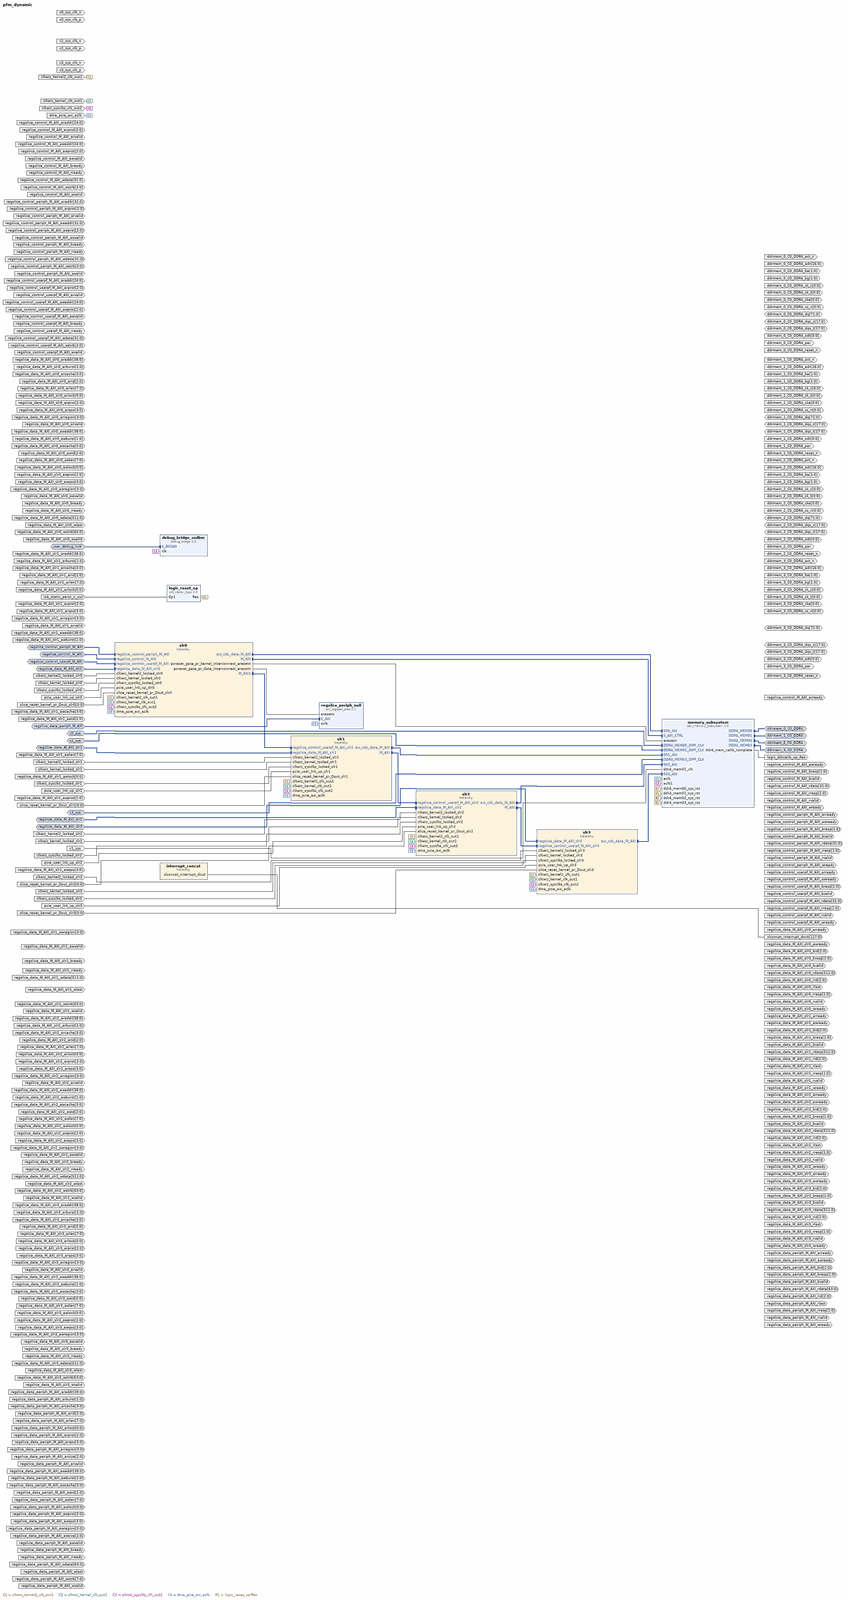
[diagram p0: block diagram of the top level, whole]
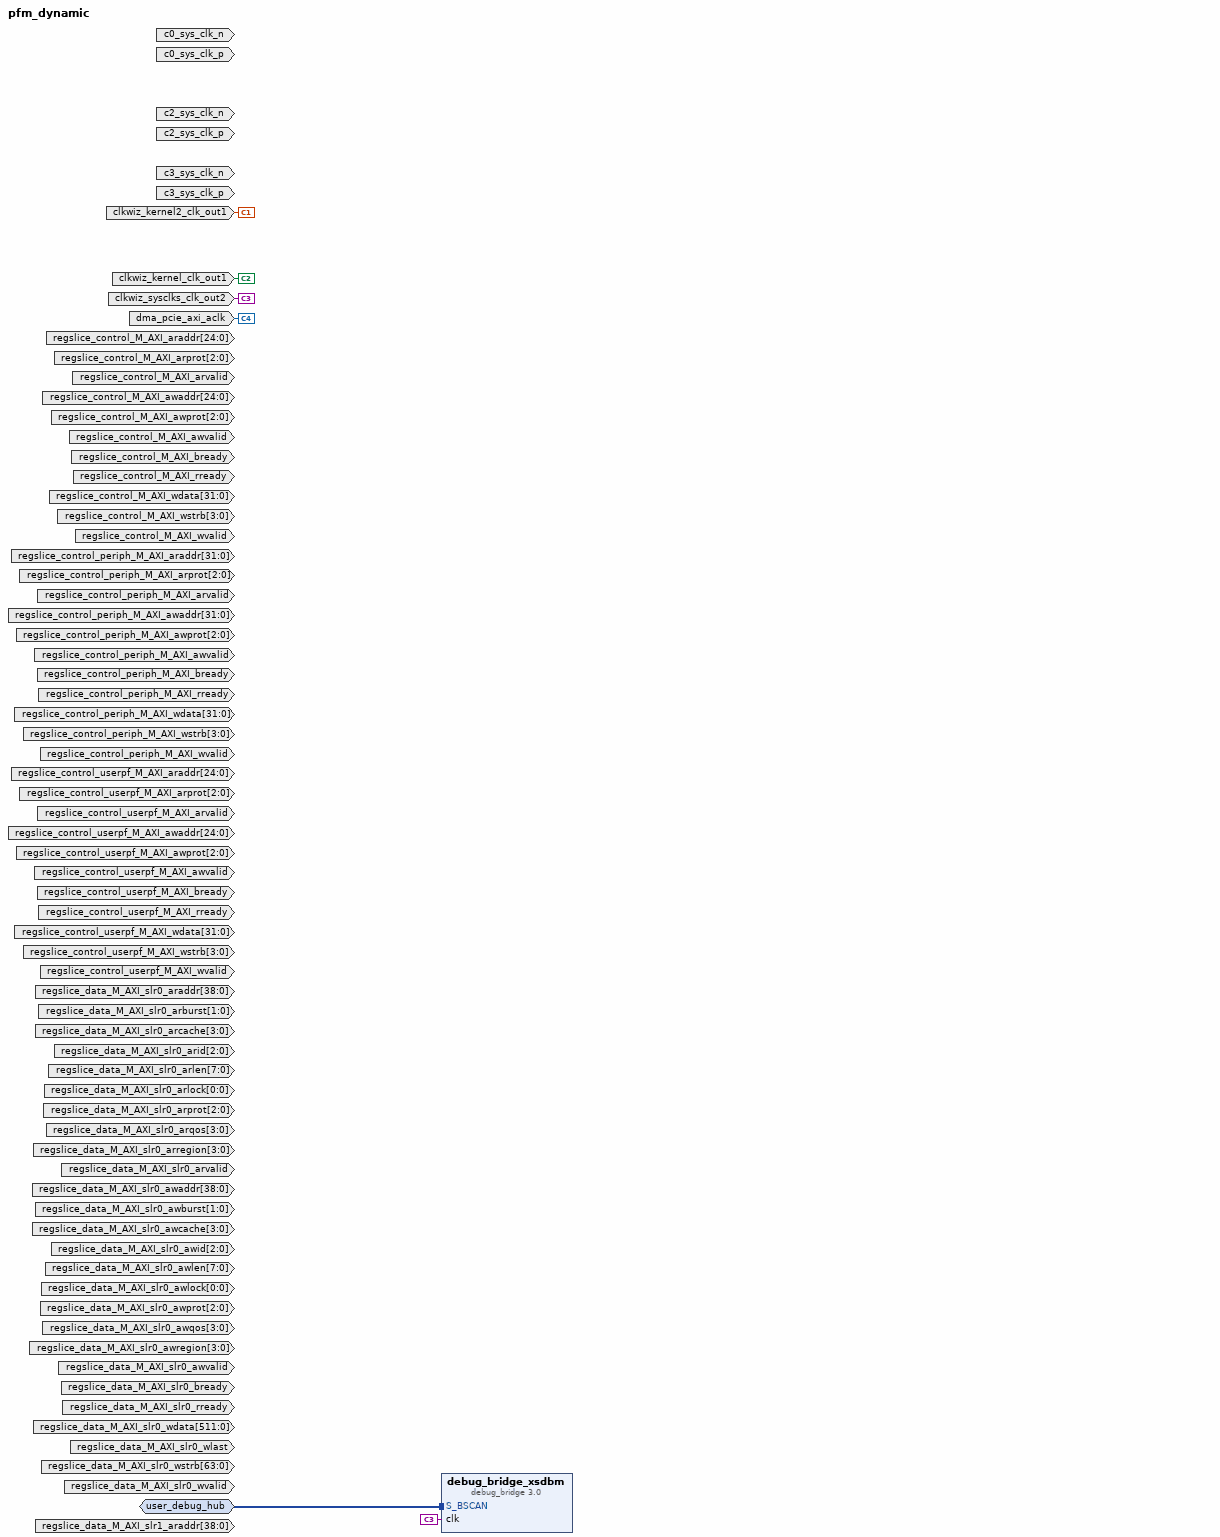
[diagram p1: block diagram of the top level, upper left part]
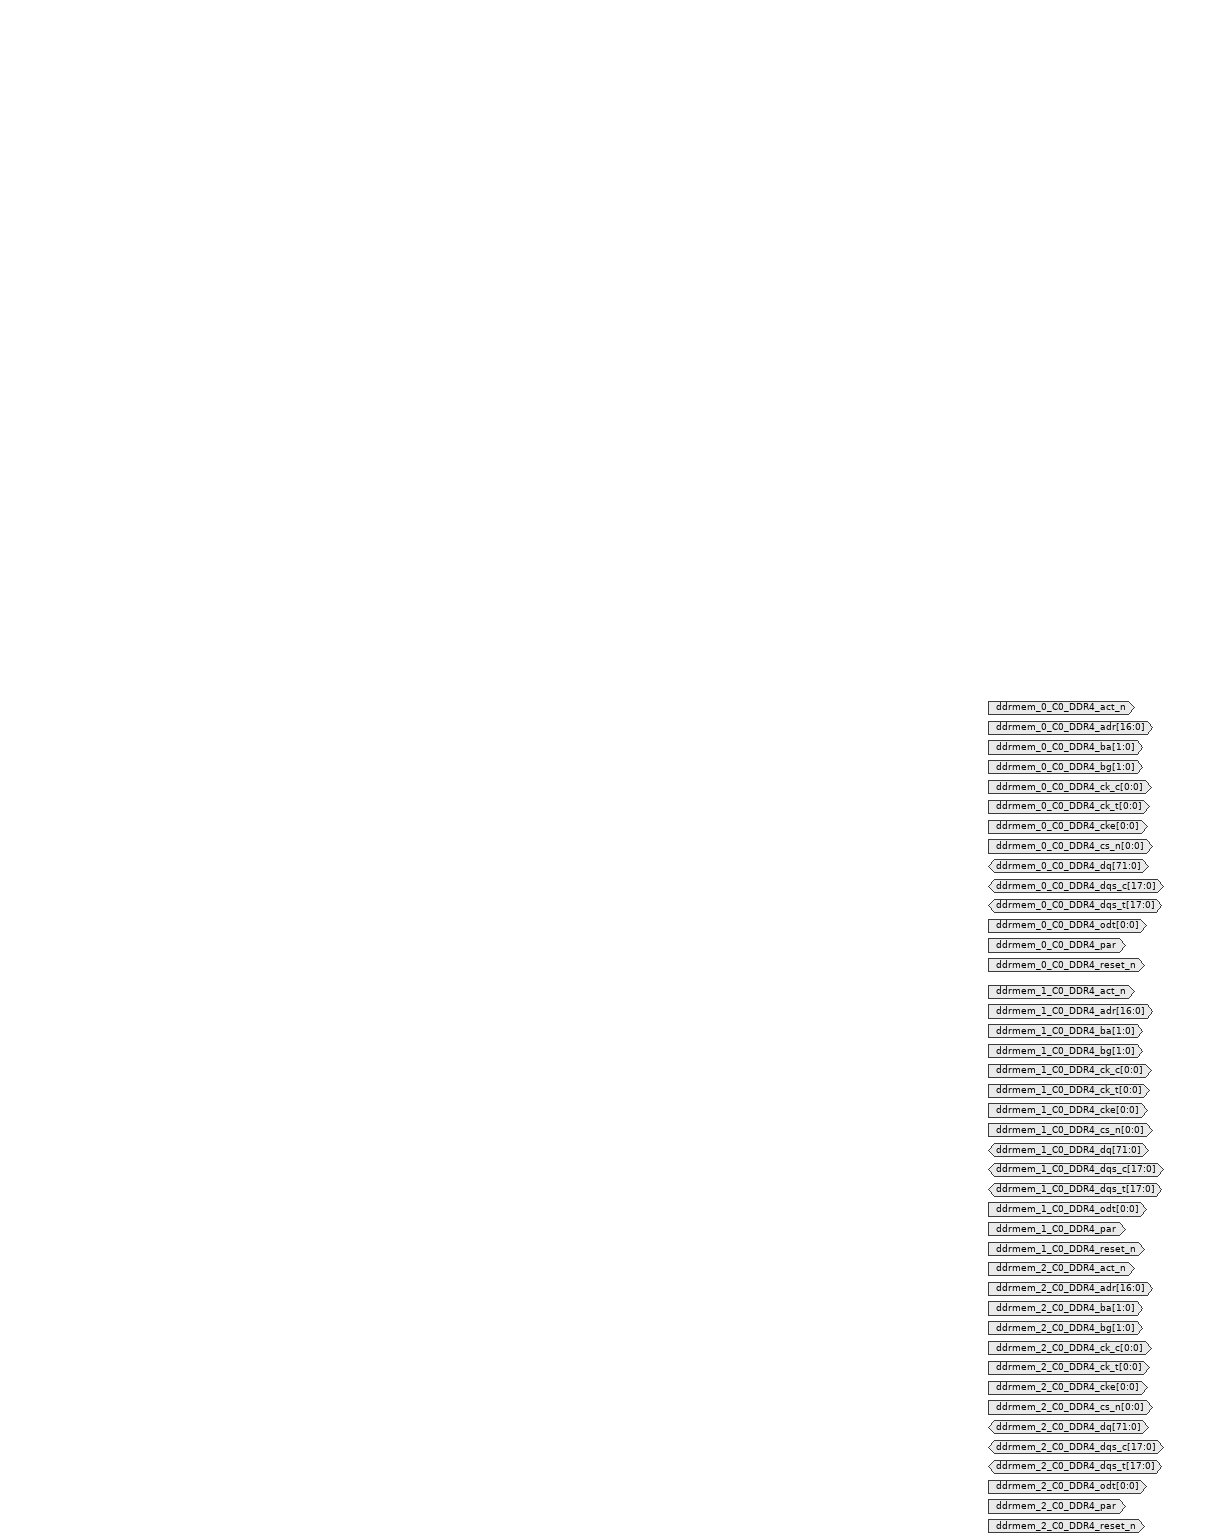
[diagram p2: block diagram of the top level, upper right part]
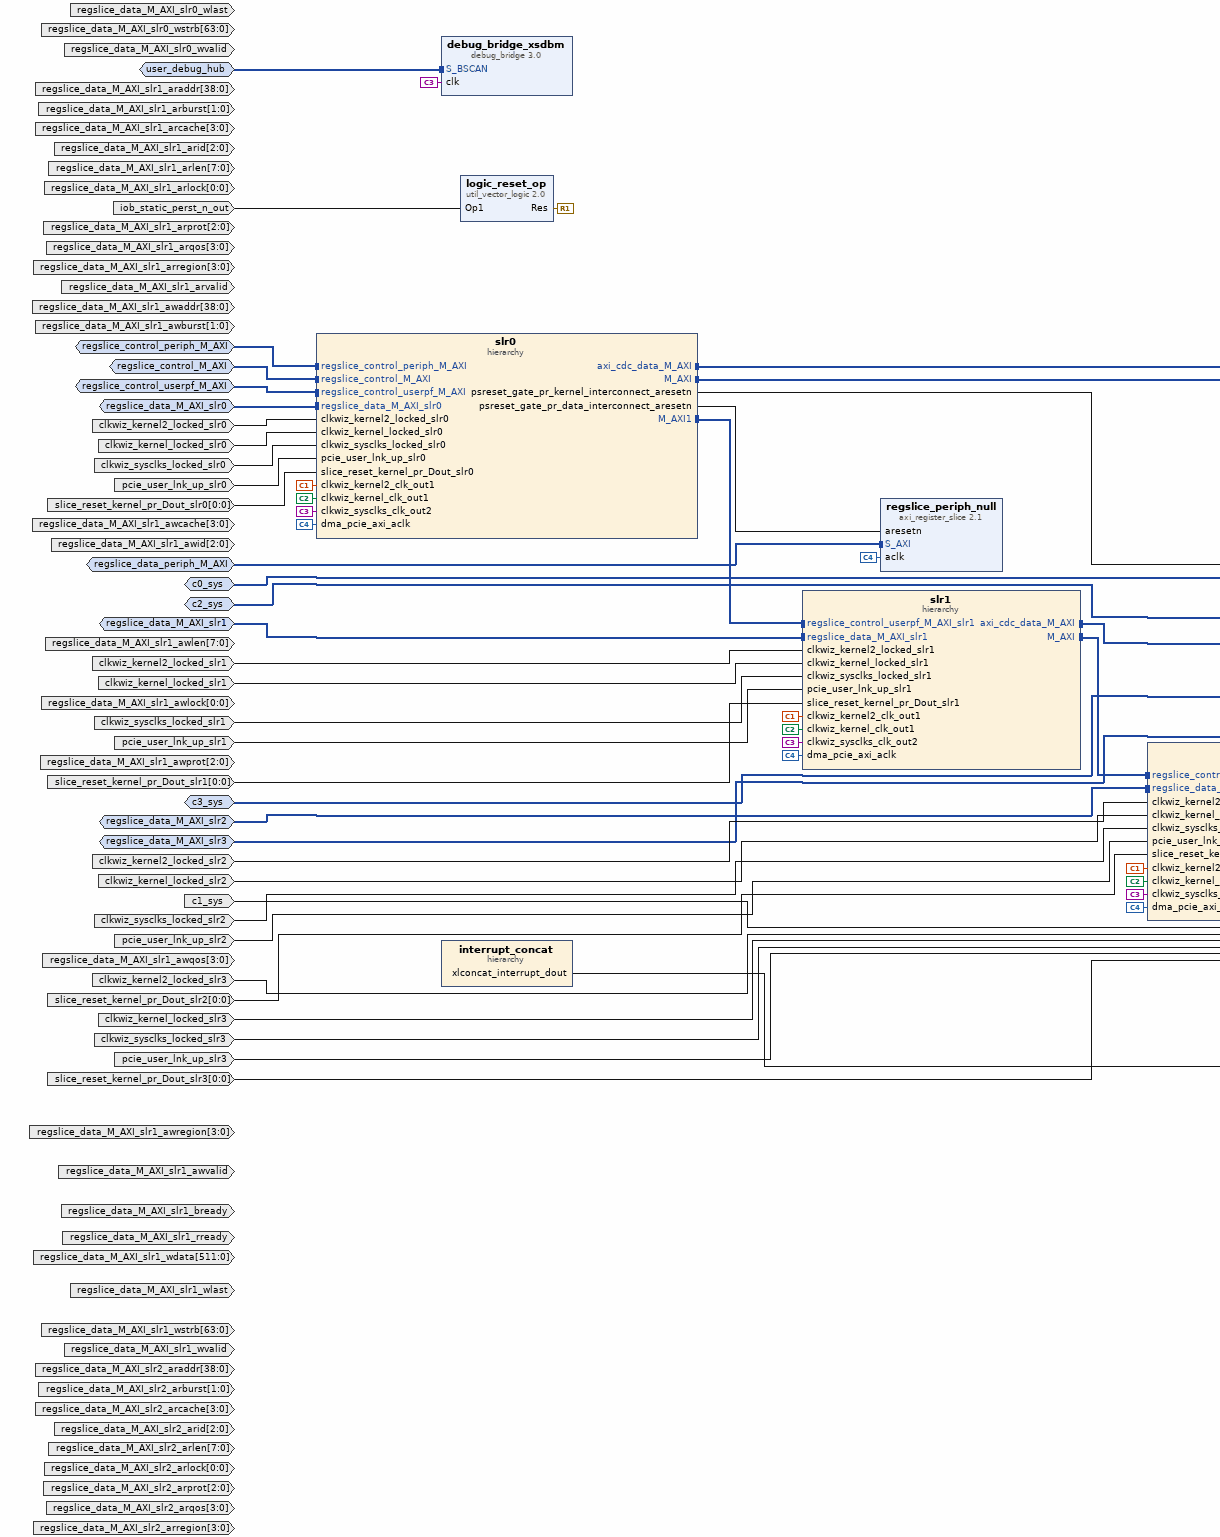
[diagram p3: block diagram of the top level, middle left part]
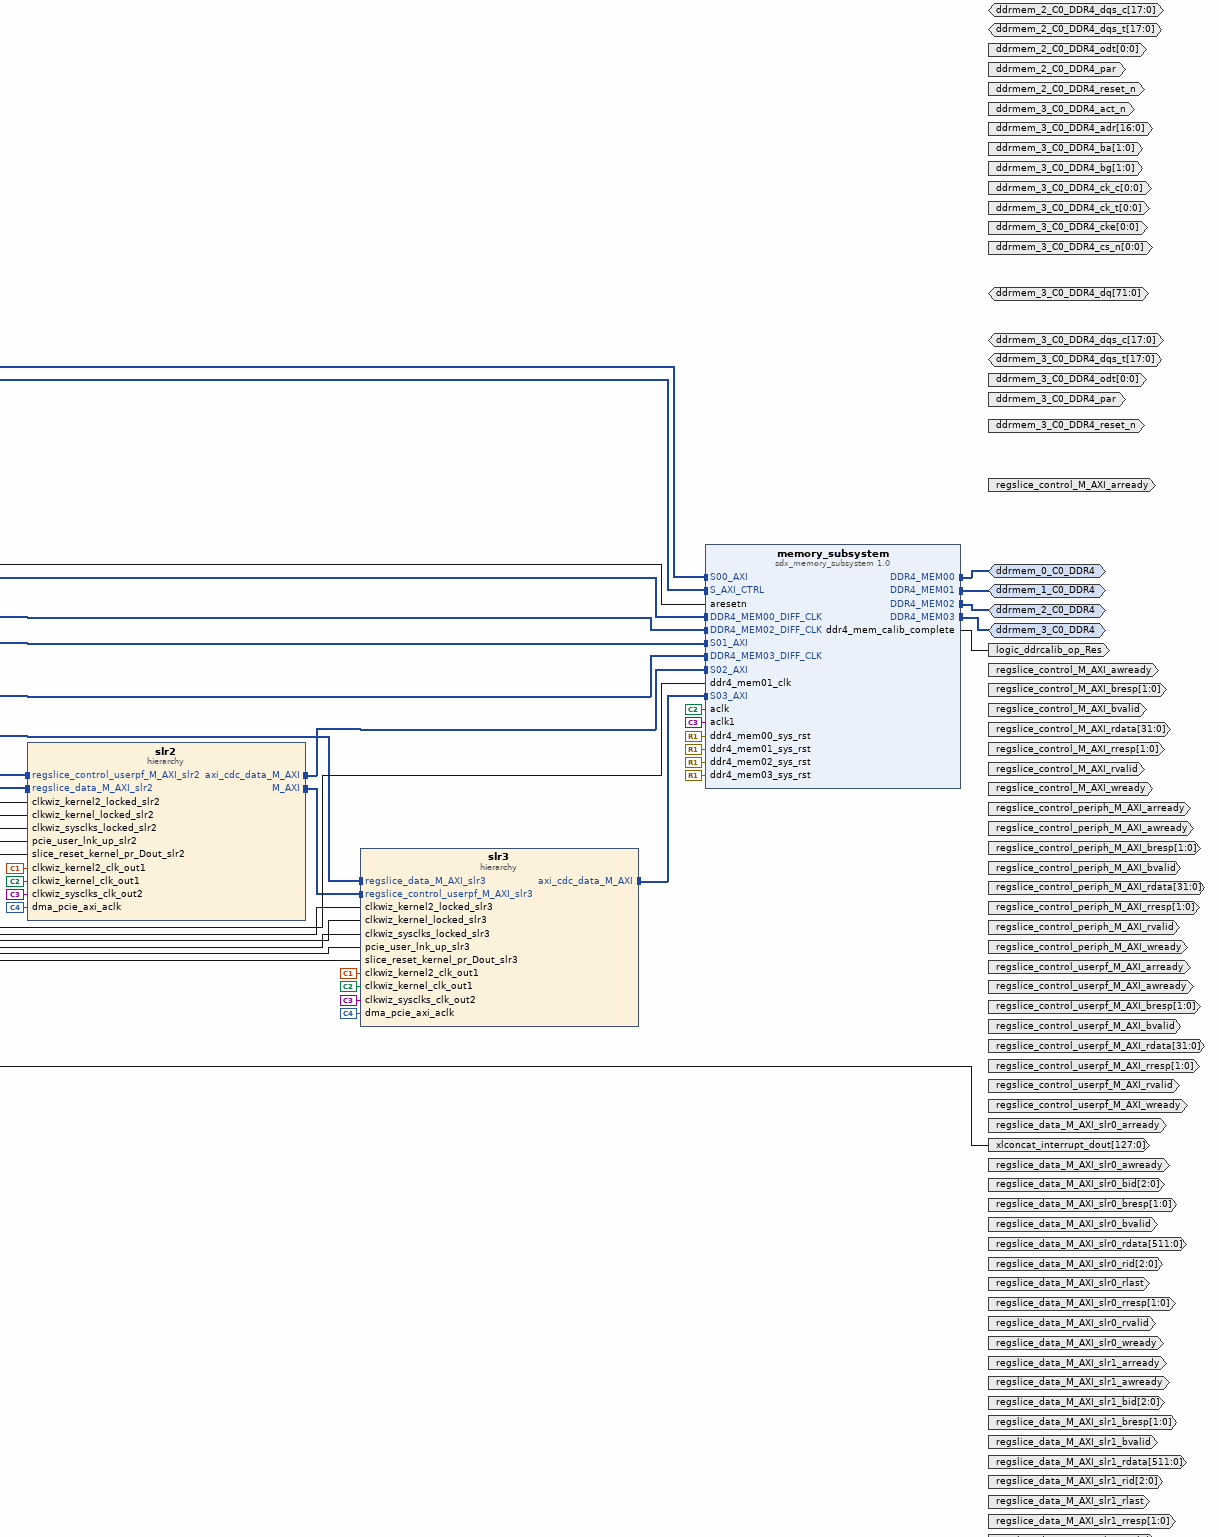
[diagram p4: block diagram of the top level, middle right part]
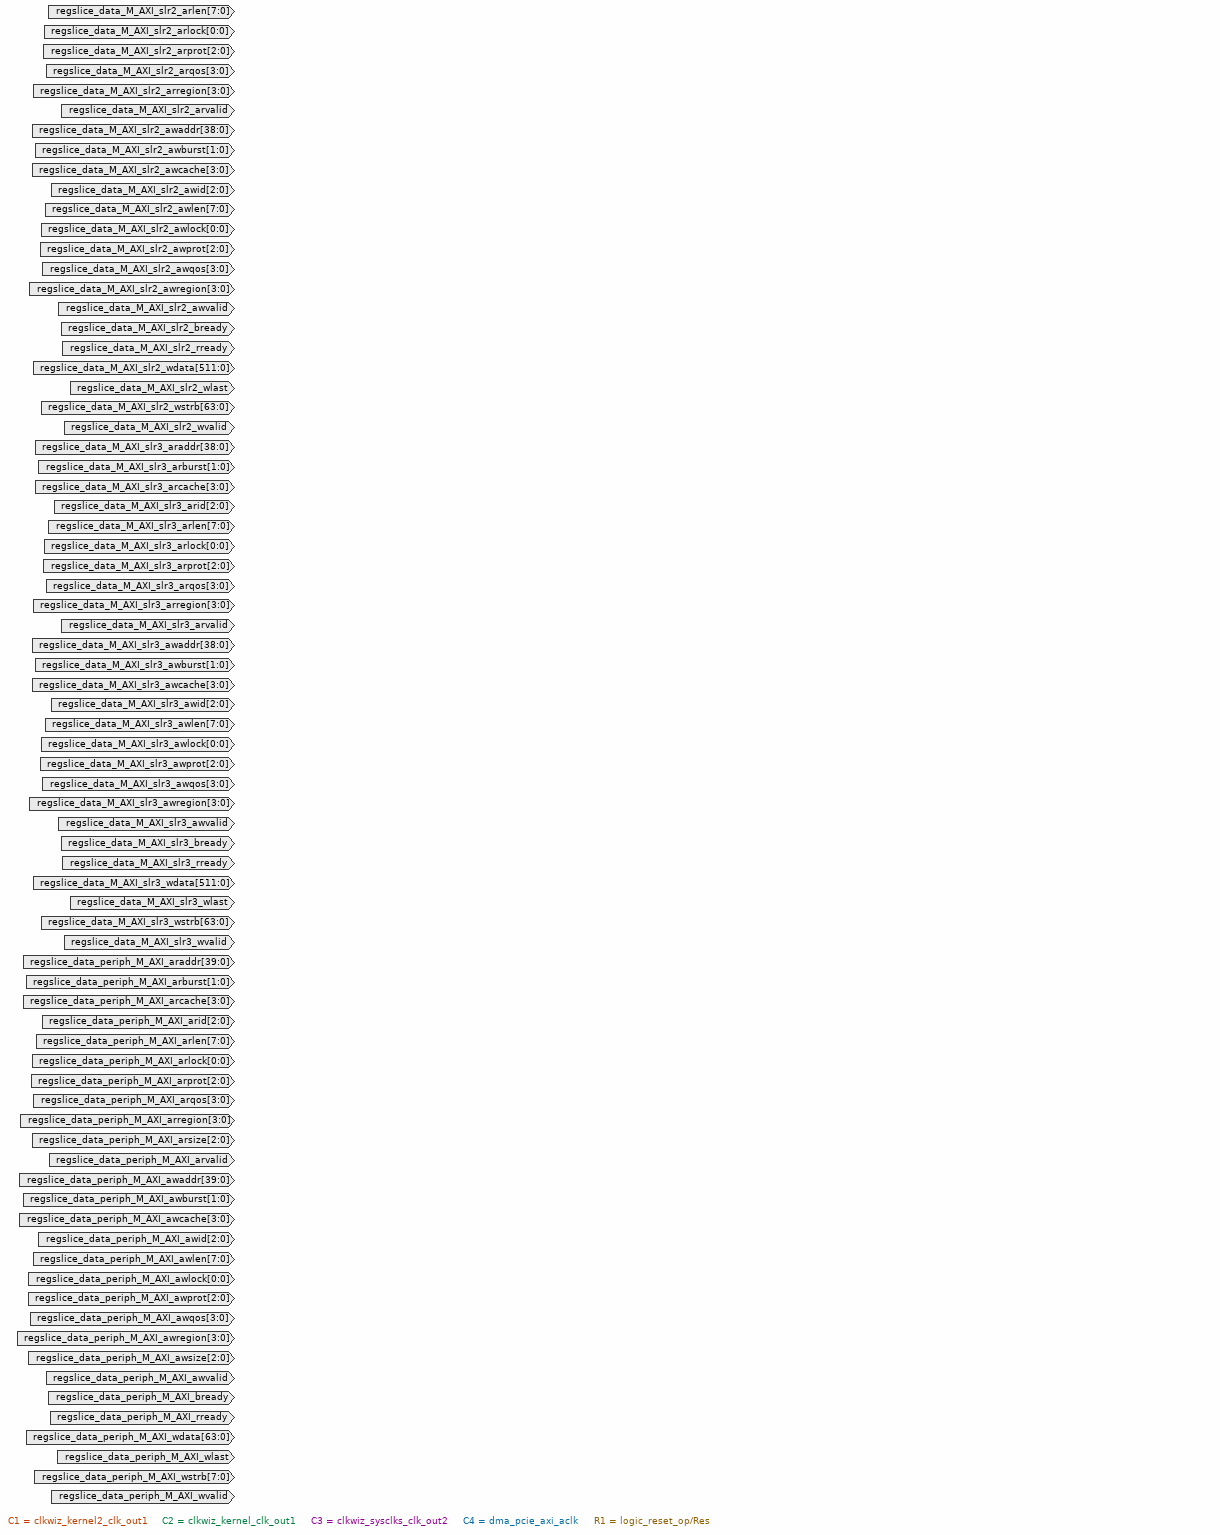
[diagram p5: block diagram of the top level, lower left part]
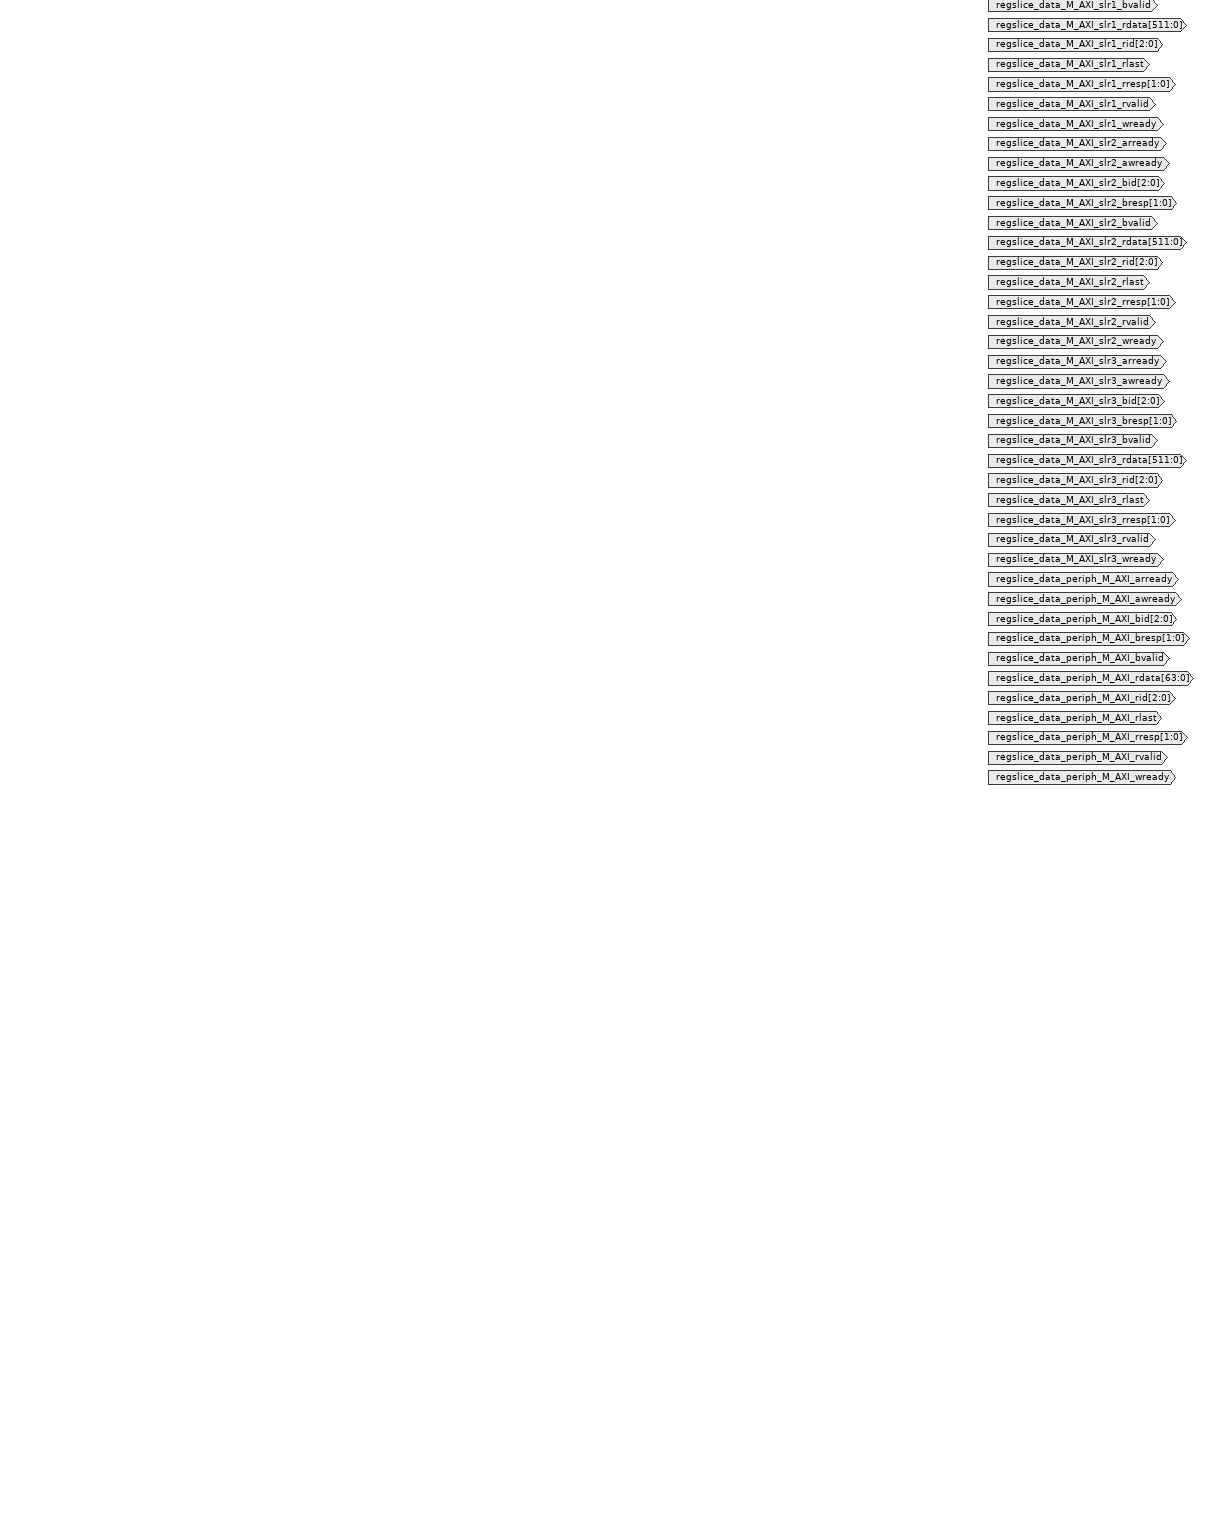
[diagram p6: block diagram of the top level, lower right part]
# Vivado block design pfm_dynamic, xcu250-figd2104-2L-e, Vivado 2018.3
create_bd_design pfm_dynamic

create_bd_intf_port -mode Slave -vlnv xilinx.com:interface:diff_clock_rtl:1.0 c0_sys
set_property -dict {CONFIG.CAN_DEBUG false CONFIG.FREQ_HZ 300000000} [get_bd_intf_ports c0_sys]
create_bd_intf_port -mode Slave -vlnv xilinx.com:interface:diff_clock_rtl:1.0 c2_sys
set_property -dict {CONFIG.CAN_DEBUG false CONFIG.FREQ_HZ 300000000} [get_bd_intf_ports c2_sys]
create_bd_intf_port -mode Slave -vlnv xilinx.com:interface:diff_clock_rtl:1.0 c3_sys
set_property -dict {CONFIG.CAN_DEBUG false CONFIG.FREQ_HZ 300000000} [get_bd_intf_ports c3_sys]
create_bd_intf_port -mode Master -vlnv xilinx.com:interface:ddr4_rtl:1.0 ddrmem_0_C0_DDR4
set_property -dict {CONFIG.CAN_DEBUG false} [get_bd_intf_ports ddrmem_0_C0_DDR4]
create_bd_intf_port -mode Master -vlnv xilinx.com:interface:ddr4_rtl:1.0 ddrmem_1_C0_DDR4
set_property -dict {CONFIG.CAN_DEBUG false} [get_bd_intf_ports ddrmem_1_C0_DDR4]
create_bd_intf_port -mode Master -vlnv xilinx.com:interface:ddr4_rtl:1.0 ddrmem_2_C0_DDR4
set_property -dict {CONFIG.CAN_DEBUG false} [get_bd_intf_ports ddrmem_2_C0_DDR4]
create_bd_intf_port -mode Master -vlnv xilinx.com:interface:ddr4_rtl:1.0 ddrmem_3_C0_DDR4
set_property -dict {CONFIG.CAN_DEBUG false} [get_bd_intf_ports ddrmem_3_C0_DDR4]
create_bd_intf_port -mode Slave -vlnv xilinx.com:interface:aximm_rtl:1.0 regslice_control_M_AXI
set_property -dict [list \
  CONFIG.ADDR_WIDTH 25 \
  CONFIG.ARUSER_WIDTH 0 \
  CONFIG.AWUSER_WIDTH 0 \
  CONFIG.BUSER_WIDTH 0 \
  CONFIG.CLK_DOMAIN pfm_dynamic_clkwiz_sysclks_clk_out2 \
  CONFIG.DATA_WIDTH 32 \
  CONFIG.FREQ_HZ 50925925 \
  CONFIG.HAS_BRESP 1 \
  CONFIG.HAS_BURST 0 \
  CONFIG.HAS_CACHE 0 \
  CONFIG.HAS_LOCK 0 \
  CONFIG.HAS_PROT 1 \
  CONFIG.HAS_QOS 0 \
  CONFIG.HAS_REGION 0 \
  CONFIG.HAS_RRESP 1 \
  CONFIG.HAS_WSTRB 1 \
  CONFIG.ID_WIDTH 0 \
  CONFIG.MAX_BURST_LENGTH 1 \
  CONFIG.NUM_READ_OUTSTANDING 2 \
  CONFIG.NUM_READ_THREADS 1 \
  CONFIG.NUM_WRITE_OUTSTANDING 2 \
  CONFIG.NUM_WRITE_THREADS 1 \
  CONFIG.PHASE 0.000 \
  CONFIG.PROTOCOL AXI4LITE \
  CONFIG.READ_WRITE_MODE READ_WRITE \
  CONFIG.RUSER_BITS_PER_BYTE 0 \
  CONFIG.RUSER_WIDTH 0 \
  CONFIG.SUPPORTS_NARROW_BURST 0 \
  CONFIG.WUSER_BITS_PER_BYTE 0 \
  CONFIG.WUSER_WIDTH 0 \
] [get_bd_intf_ports regslice_control_M_AXI]
create_bd_intf_port -mode Slave -vlnv xilinx.com:interface:aximm_rtl:1.0 regslice_control_periph_M_AXI
set_property -dict [list \
  CONFIG.ADDR_WIDTH 32 \
  CONFIG.ARUSER_WIDTH 0 \
  CONFIG.AWUSER_WIDTH 0 \
  CONFIG.BUSER_WIDTH 0 \
  CONFIG.DATA_WIDTH 32 \
  CONFIG.FREQ_HZ 50925925 \
  CONFIG.HAS_BRESP 1 \
  CONFIG.HAS_BURST 0 \
  CONFIG.HAS_CACHE 0 \
  CONFIG.HAS_LOCK 0 \
  CONFIG.HAS_PROT 1 \
  CONFIG.HAS_QOS 0 \
  CONFIG.HAS_REGION 0 \
  CONFIG.HAS_RRESP 1 \
  CONFIG.HAS_WSTRB 1 \
  CONFIG.ID_WIDTH 0 \
  CONFIG.MAX_BURST_LENGTH 1 \
  CONFIG.NUM_READ_OUTSTANDING 1 \
  CONFIG.NUM_READ_THREADS 1 \
  CONFIG.NUM_WRITE_OUTSTANDING 1 \
  CONFIG.NUM_WRITE_THREADS 1 \
  CONFIG.PROTOCOL AXI4LITE \
  CONFIG.READ_WRITE_MODE READ_WRITE \
  CONFIG.RUSER_BITS_PER_BYTE 0 \
  CONFIG.RUSER_WIDTH 0 \
  CONFIG.SUPPORTS_NARROW_BURST 0 \
  CONFIG.WUSER_BITS_PER_BYTE 0 \
  CONFIG.WUSER_WIDTH 0 \
] [get_bd_intf_ports regslice_control_periph_M_AXI]
create_bd_intf_port -mode Slave -vlnv xilinx.com:interface:aximm_rtl:1.0 regslice_control_userpf_M_AXI
set_property -dict [list \
  CONFIG.ADDR_WIDTH 25 \
  CONFIG.ARUSER_WIDTH 0 \
  CONFIG.AWUSER_WIDTH 0 \
  CONFIG.BUSER_WIDTH 0 \
  CONFIG.CLK_DOMAIN pfm_dynamic_clkwiz_sysclks_clk_out2 \
  CONFIG.DATA_WIDTH 32 \
  CONFIG.FREQ_HZ 50925925 \
  CONFIG.HAS_BRESP 1 \
  CONFIG.HAS_BURST 0 \
  CONFIG.HAS_CACHE 0 \
  CONFIG.HAS_LOCK 0 \
  CONFIG.HAS_PROT 1 \
  CONFIG.HAS_QOS 0 \
  CONFIG.HAS_REGION 0 \
  CONFIG.HAS_RRESP 1 \
  CONFIG.HAS_WSTRB 1 \
  CONFIG.ID_WIDTH 0 \
  CONFIG.MAX_BURST_LENGTH 1 \
  CONFIG.NUM_READ_OUTSTANDING 2 \
  CONFIG.NUM_READ_THREADS 1 \
  CONFIG.NUM_WRITE_OUTSTANDING 2 \
  CONFIG.NUM_WRITE_THREADS 1 \
  CONFIG.PHASE 0.000 \
  CONFIG.PROTOCOL AXI4LITE \
  CONFIG.READ_WRITE_MODE READ_WRITE \
  CONFIG.RUSER_BITS_PER_BYTE 0 \
  CONFIG.RUSER_WIDTH 0 \
  CONFIG.SUPPORTS_NARROW_BURST 0 \
  CONFIG.WUSER_BITS_PER_BYTE 0 \
  CONFIG.WUSER_WIDTH 0 \
] [get_bd_intf_ports regslice_control_userpf_M_AXI]
create_bd_intf_port -mode Slave -vlnv xilinx.com:interface:aximm_rtl:1.0 regslice_data_M_AXI_slr0
set_property -dict [list \
  CONFIG.ADDR_WIDTH 39 \
  CONFIG.ARUSER_WIDTH 0 \
  CONFIG.AWUSER_WIDTH 0 \
  CONFIG.BUSER_WIDTH 0 \
  CONFIG.CLK_DOMAIN pfm_dynamic_dma_pcie_axi_aclk \
  CONFIG.DATA_WIDTH 512 \
  CONFIG.FREQ_HZ 250000000 \
  CONFIG.HAS_BRESP 1 \
  CONFIG.HAS_BURST 1 \
  CONFIG.HAS_CACHE 1 \
  CONFIG.HAS_LOCK 1 \
  CONFIG.HAS_PROT 1 \
  CONFIG.HAS_QOS 1 \
  CONFIG.HAS_REGION 1 \
  CONFIG.HAS_RRESP 1 \
  CONFIG.HAS_WSTRB 1 \
  CONFIG.ID_WIDTH 3 \
  CONFIG.MAX_BURST_LENGTH 256 \
  CONFIG.NUM_READ_OUTSTANDING 16 \
  CONFIG.NUM_READ_THREADS 2 \
  CONFIG.NUM_WRITE_OUTSTANDING 16 \
  CONFIG.NUM_WRITE_THREADS 2 \
  CONFIG.PHASE 0.000 \
  CONFIG.PROTOCOL AXI4 \
  CONFIG.READ_WRITE_MODE READ_WRITE \
  CONFIG.RUSER_BITS_PER_BYTE 0 \
  CONFIG.RUSER_WIDTH 0 \
  CONFIG.SUPPORTS_NARROW_BURST 0 \
  CONFIG.WUSER_BITS_PER_BYTE 0 \
  CONFIG.WUSER_WIDTH 0 \
] [get_bd_intf_ports regslice_data_M_AXI_slr0]
create_bd_intf_port -mode Slave -vlnv xilinx.com:interface:aximm_rtl:1.0 regslice_data_M_AXI_slr1
set_property -dict [list \
  CONFIG.ADDR_WIDTH 39 \
  CONFIG.ARUSER_WIDTH 0 \
  CONFIG.AWUSER_WIDTH 0 \
  CONFIG.BUSER_WIDTH 0 \
  CONFIG.CLK_DOMAIN pfm_dynamic_dma_pcie_axi_aclk \
  CONFIG.DATA_WIDTH 512 \
  CONFIG.FREQ_HZ 250000000 \
  CONFIG.HAS_BRESP 1 \
  CONFIG.HAS_BURST 1 \
  CONFIG.HAS_CACHE 1 \
  CONFIG.HAS_LOCK 1 \
  CONFIG.HAS_PROT 1 \
  CONFIG.HAS_QOS 1 \
  CONFIG.HAS_REGION 1 \
  CONFIG.HAS_RRESP 1 \
  CONFIG.HAS_WSTRB 1 \
  CONFIG.ID_WIDTH 3 \
  CONFIG.MAX_BURST_LENGTH 256 \
  CONFIG.NUM_READ_OUTSTANDING 16 \
  CONFIG.NUM_READ_THREADS 2 \
  CONFIG.NUM_WRITE_OUTSTANDING 16 \
  CONFIG.NUM_WRITE_THREADS 2 \
  CONFIG.PHASE 0.000 \
  CONFIG.PROTOCOL AXI4 \
  CONFIG.READ_WRITE_MODE READ_WRITE \
  CONFIG.RUSER_BITS_PER_BYTE 0 \
  CONFIG.RUSER_WIDTH 0 \
  CONFIG.SUPPORTS_NARROW_BURST 0 \
  CONFIG.WUSER_BITS_PER_BYTE 0 \
  CONFIG.WUSER_WIDTH 0 \
] [get_bd_intf_ports regslice_data_M_AXI_slr1]
create_bd_intf_port -mode Slave -vlnv xilinx.com:interface:aximm_rtl:1.0 regslice_data_M_AXI_slr2
set_property -dict [list \
  CONFIG.ADDR_WIDTH 39 \
  CONFIG.ARUSER_WIDTH 0 \
  CONFIG.AWUSER_WIDTH 0 \
  CONFIG.BUSER_WIDTH 0 \
  CONFIG.CLK_DOMAIN pfm_dynamic_dma_pcie_axi_aclk \
  CONFIG.DATA_WIDTH 512 \
  CONFIG.FREQ_HZ 250000000 \
  CONFIG.HAS_BRESP 1 \
  CONFIG.HAS_BURST 1 \
  CONFIG.HAS_CACHE 1 \
  CONFIG.HAS_LOCK 1 \
  CONFIG.HAS_PROT 1 \
  CONFIG.HAS_QOS 1 \
  CONFIG.HAS_REGION 1 \
  CONFIG.HAS_RRESP 1 \
  CONFIG.HAS_WSTRB 1 \
  CONFIG.ID_WIDTH 3 \
  CONFIG.MAX_BURST_LENGTH 256 \
  CONFIG.NUM_READ_OUTSTANDING 16 \
  CONFIG.NUM_READ_THREADS 2 \
  CONFIG.NUM_WRITE_OUTSTANDING 16 \
  CONFIG.NUM_WRITE_THREADS 2 \
  CONFIG.PHASE 0.000 \
  CONFIG.PROTOCOL AXI4 \
  CONFIG.READ_WRITE_MODE READ_WRITE \
  CONFIG.RUSER_BITS_PER_BYTE 0 \
  CONFIG.RUSER_WIDTH 0 \
  CONFIG.SUPPORTS_NARROW_BURST 0 \
  CONFIG.WUSER_BITS_PER_BYTE 0 \
  CONFIG.WUSER_WIDTH 0 \
] [get_bd_intf_ports regslice_data_M_AXI_slr2]
create_bd_intf_port -mode Slave -vlnv xilinx.com:interface:aximm_rtl:1.0 regslice_data_M_AXI_slr3
set_property -dict [list \
  CONFIG.ADDR_WIDTH 39 \
  CONFIG.ARUSER_WIDTH 0 \
  CONFIG.AWUSER_WIDTH 0 \
  CONFIG.BUSER_WIDTH 0 \
  CONFIG.CLK_DOMAIN pfm_dynamic_dma_pcie_axi_aclk \
  CONFIG.DATA_WIDTH 512 \
  CONFIG.FREQ_HZ 250000000 \
  CONFIG.HAS_BRESP 1 \
  CONFIG.HAS_BURST 1 \
  CONFIG.HAS_CACHE 1 \
  CONFIG.HAS_LOCK 1 \
  CONFIG.HAS_PROT 1 \
  CONFIG.HAS_QOS 1 \
  CONFIG.HAS_REGION 1 \
  CONFIG.HAS_RRESP 1 \
  CONFIG.HAS_WSTRB 1 \
  CONFIG.ID_WIDTH 3 \
  CONFIG.MAX_BURST_LENGTH 256 \
  CONFIG.NUM_READ_OUTSTANDING 16 \
  CONFIG.NUM_READ_THREADS 2 \
  CONFIG.NUM_WRITE_OUTSTANDING 16 \
  CONFIG.NUM_WRITE_THREADS 2 \
  CONFIG.PHASE 0.000 \
  CONFIG.PROTOCOL AXI4 \
  CONFIG.READ_WRITE_MODE READ_WRITE \
  CONFIG.RUSER_BITS_PER_BYTE 0 \
  CONFIG.RUSER_WIDTH 0 \
  CONFIG.SUPPORTS_NARROW_BURST 0 \
  CONFIG.WUSER_BITS_PER_BYTE 0 \
  CONFIG.WUSER_WIDTH 0 \
] [get_bd_intf_ports regslice_data_M_AXI_slr3]
create_bd_intf_port -mode Slave -vlnv xilinx.com:interface:aximm_rtl:1.0 regslice_data_periph_M_AXI
set_property -dict [list \
  CONFIG.ADDR_WIDTH 40 \
  CONFIG.ARUSER_WIDTH 0 \
  CONFIG.AWUSER_WIDTH 0 \
  CONFIG.BUSER_WIDTH 0 \
  CONFIG.DATA_WIDTH 64 \
  CONFIG.FREQ_HZ 250000000 \
  CONFIG.HAS_BRESP 1 \
  CONFIG.HAS_BURST 1 \
  CONFIG.HAS_CACHE 1 \
  CONFIG.HAS_LOCK 1 \
  CONFIG.HAS_PROT 1 \
  CONFIG.HAS_QOS 1 \
  CONFIG.HAS_REGION 1 \
  CONFIG.HAS_RRESP 1 \
  CONFIG.HAS_WSTRB 1 \
  CONFIG.ID_WIDTH 3 \
  CONFIG.MAX_BURST_LENGTH 256 \
  CONFIG.NUM_READ_OUTSTANDING 16 \
  CONFIG.NUM_READ_THREADS 1 \
  CONFIG.NUM_WRITE_OUTSTANDING 16 \
  CONFIG.NUM_WRITE_THREADS 1 \
  CONFIG.PROTOCOL AXI4 \
  CONFIG.READ_WRITE_MODE READ_WRITE \
  CONFIG.RUSER_BITS_PER_BYTE 0 \
  CONFIG.RUSER_WIDTH 0 \
  CONFIG.SUPPORTS_NARROW_BURST 0 \
  CONFIG.WUSER_BITS_PER_BYTE 0 \
  CONFIG.WUSER_WIDTH 0 \
] [get_bd_intf_ports regslice_data_periph_M_AXI]
create_bd_intf_port -mode Slave -vlnv xilinx.com:interface:bscan_rtl:1.0 user_debug_hub
create_bd_port -dir I -type clk c1_sys
set_property -dict {CONFIG.FREQ_HZ 300000000} [get_bd_ports c1_sys]
create_bd_port -dir I -type clk clkwiz_kernel2_clk_out1
set_property -dict {CONFIG.FREQ_HZ 500000000} [get_bd_ports clkwiz_kernel2_clk_out1]
create_bd_port -dir I clkwiz_kernel2_locked_slr0
create_bd_port -dir I clkwiz_kernel2_locked_slr1
create_bd_port -dir I clkwiz_kernel2_locked_slr2
create_bd_port -dir I clkwiz_kernel2_locked_slr3
create_bd_port -dir I -type clk clkwiz_kernel_clk_out1
set_property -dict {CONFIG.FREQ_HZ 300000000} [get_bd_ports clkwiz_kernel_clk_out1]
create_bd_port -dir I clkwiz_kernel_locked_slr0
create_bd_port -dir I clkwiz_kernel_locked_slr1
create_bd_port -dir I clkwiz_kernel_locked_slr2
create_bd_port -dir I clkwiz_kernel_locked_slr3
create_bd_port -dir I -type clk clkwiz_sysclks_clk_out2
set_property -dict [list \
  CONFIG.ASSOCIATED_BUSIF regslice_control_M_AXI:regslice_control_periph_M_AXI:regslice_control_userpf_M_AXI \
  CONFIG.FREQ_HZ 50925925 \
] [get_bd_ports clkwiz_sysclks_clk_out2]
create_bd_port -dir I clkwiz_sysclks_locked_slr0
create_bd_port -dir I clkwiz_sysclks_locked_slr1
create_bd_port -dir I clkwiz_sysclks_locked_slr2
create_bd_port -dir I clkwiz_sysclks_locked_slr3
create_bd_port -dir I -type clk dma_pcie_axi_aclk
set_property -dict [list \
  CONFIG.ASSOCIATED_BUSIF regslice_data_M_AXI_slr0:regslice_data_M_AXI_slr1:regslice_data_M_AXI_slr2:regslice_data_M_AXI_slr3:regslice_data_periph_M_AXI \
  CONFIG.FREQ_HZ 250000000 \
] [get_bd_ports dma_pcie_axi_aclk]
create_bd_port -dir I iob_static_perst_n_out
create_bd_port -dir O logic_ddrcalib_op_Res
create_bd_port -dir I pcie_user_lnk_up_slr0
create_bd_port -dir I pcie_user_lnk_up_slr1
create_bd_port -dir I pcie_user_lnk_up_slr2
create_bd_port -dir I pcie_user_lnk_up_slr3
create_bd_port -dir I -from 0 -to 0 -type rst slice_reset_kernel_pr_Dout_slr0
set_property -dict {CONFIG.POLARITY ACTIVE_LOW} [get_bd_ports slice_reset_kernel_pr_Dout_slr0]
create_bd_port -dir I -from 0 -to 0 -type rst slice_reset_kernel_pr_Dout_slr1
set_property -dict {CONFIG.POLARITY ACTIVE_LOW} [get_bd_ports slice_reset_kernel_pr_Dout_slr1]
create_bd_port -dir I -from 0 -to 0 -type rst slice_reset_kernel_pr_Dout_slr2
set_property -dict {CONFIG.POLARITY ACTIVE_LOW} [get_bd_ports slice_reset_kernel_pr_Dout_slr2]
create_bd_port -dir I -from 0 -to 0 -type rst slice_reset_kernel_pr_Dout_slr3
set_property -dict {CONFIG.POLARITY ACTIVE_LOW} [get_bd_ports slice_reset_kernel_pr_Dout_slr3]
create_bd_port -dir O -from 127 -to 0 xlconcat_interrupt_dout
create_bd_port -dir IO -from 71 -to 0 ddrmem_0_C0_DDR4_dq
create_bd_port -dir IO -from 17 -to 0 ddrmem_0_C0_DDR4_dqs_t
create_bd_port -dir IO -from 17 -to 0 ddrmem_0_C0_DDR4_dqs_c
create_bd_port -dir O -from 16 -to 0 ddrmem_0_C0_DDR4_adr
create_bd_port -dir O -from 1 -to 0 ddrmem_0_C0_DDR4_ba
create_bd_port -dir O -from 1 -to 0 ddrmem_0_C0_DDR4_bg
create_bd_port -dir O ddrmem_0_C0_DDR4_act_n
create_bd_port -dir O ddrmem_0_C0_DDR4_reset_n
create_bd_port -dir O -from 0 -to 0 -type clk ddrmem_0_C0_DDR4_ck_t
create_bd_port -dir O -from 0 -to 0 -type clk ddrmem_0_C0_DDR4_ck_c
create_bd_port -dir O -from 0 -to 0 ddrmem_0_C0_DDR4_cke
create_bd_port -dir O -from 0 -to 0 ddrmem_0_C0_DDR4_cs_n
create_bd_port -dir O -from 0 -to 0 ddrmem_0_C0_DDR4_odt
create_bd_port -dir O ddrmem_0_C0_DDR4_par
create_bd_port -dir IO -from 71 -to 0 ddrmem_1_C0_DDR4_dq
create_bd_port -dir IO -from 17 -to 0 ddrmem_1_C0_DDR4_dqs_t
create_bd_port -dir IO -from 17 -to 0 ddrmem_1_C0_DDR4_dqs_c
create_bd_port -dir O -from 16 -to 0 ddrmem_1_C0_DDR4_adr
create_bd_port -dir O -from 1 -to 0 ddrmem_1_C0_DDR4_ba
create_bd_port -dir O -from 1 -to 0 ddrmem_1_C0_DDR4_bg
create_bd_port -dir O ddrmem_1_C0_DDR4_act_n
create_bd_port -dir O ddrmem_1_C0_DDR4_reset_n
create_bd_port -dir O -from 0 -to 0 -type clk ddrmem_1_C0_DDR4_ck_t
create_bd_port -dir O -from 0 -to 0 -type clk ddrmem_1_C0_DDR4_ck_c
create_bd_port -dir O -from 0 -to 0 ddrmem_1_C0_DDR4_cke
create_bd_port -dir O -from 0 -to 0 ddrmem_1_C0_DDR4_cs_n
create_bd_port -dir O -from 0 -to 0 ddrmem_1_C0_DDR4_odt
create_bd_port -dir O ddrmem_1_C0_DDR4_par
create_bd_port -dir IO -from 71 -to 0 ddrmem_2_C0_DDR4_dq
create_bd_port -dir IO -from 17 -to 0 ddrmem_2_C0_DDR4_dqs_t
create_bd_port -dir IO -from 17 -to 0 ddrmem_2_C0_DDR4_dqs_c
create_bd_port -dir O -from 16 -to 0 ddrmem_2_C0_DDR4_adr
create_bd_port -dir O -from 1 -to 0 ddrmem_2_C0_DDR4_ba
create_bd_port -dir O -from 1 -to 0 ddrmem_2_C0_DDR4_bg
create_bd_port -dir O ddrmem_2_C0_DDR4_act_n
create_bd_port -dir O ddrmem_2_C0_DDR4_reset_n
create_bd_port -dir O -from 0 -to 0 -type clk ddrmem_2_C0_DDR4_ck_t
create_bd_port -dir O -from 0 -to 0 -type clk ddrmem_2_C0_DDR4_ck_c
create_bd_port -dir O -from 0 -to 0 ddrmem_2_C0_DDR4_cke
create_bd_port -dir O -from 0 -to 0 ddrmem_2_C0_DDR4_cs_n
create_bd_port -dir O -from 0 -to 0 ddrmem_2_C0_DDR4_odt
create_bd_port -dir O ddrmem_2_C0_DDR4_par
create_bd_port -dir IO -from 71 -to 0 ddrmem_3_C0_DDR4_dq
create_bd_port -dir IO -from 17 -to 0 ddrmem_3_C0_DDR4_dqs_t
create_bd_port -dir IO -from 17 -to 0 ddrmem_3_C0_DDR4_dqs_c
create_bd_port -dir O -from 16 -to 0 ddrmem_3_C0_DDR4_adr
create_bd_port -dir O -from 1 -to 0 ddrmem_3_C0_DDR4_ba
create_bd_port -dir O -from 1 -to 0 ddrmem_3_C0_DDR4_bg
create_bd_port -dir O ddrmem_3_C0_DDR4_act_n
create_bd_port -dir O ddrmem_3_C0_DDR4_reset_n
create_bd_port -dir O -from 0 -to 0 -type clk ddrmem_3_C0_DDR4_ck_t
create_bd_port -dir O -from 0 -to 0 -type clk ddrmem_3_C0_DDR4_ck_c
create_bd_port -dir O -from 0 -to 0 ddrmem_3_C0_DDR4_cke
create_bd_port -dir O -from 0 -to 0 ddrmem_3_C0_DDR4_cs_n
create_bd_port -dir O -from 0 -to 0 ddrmem_3_C0_DDR4_odt
create_bd_port -dir O ddrmem_3_C0_DDR4_par
create_bd_port -dir I -type clk c0_sys_clk_p
create_bd_port -dir I -type clk c0_sys_clk_n
create_bd_port -dir I -type clk c2_sys_clk_p
create_bd_port -dir I -type clk c2_sys_clk_n
create_bd_port -dir I -type clk c3_sys_clk_p
create_bd_port -dir I -type clk c3_sys_clk_n
create_bd_port -dir I -from 24 -to 0 regslice_control_M_AXI_araddr
create_bd_port -dir I -from 2 -to 0 regslice_control_M_AXI_arprot
create_bd_port -dir O regslice_control_M_AXI_arready
create_bd_port -dir I regslice_control_M_AXI_arvalid
create_bd_port -dir I -from 24 -to 0 regslice_control_M_AXI_awaddr
create_bd_port -dir I -from 2 -to 0 regslice_control_M_AXI_awprot
create_bd_port -dir O regslice_control_M_AXI_awready
create_bd_port -dir I regslice_control_M_AXI_awvalid
create_bd_port -dir I regslice_control_M_AXI_bready
create_bd_port -dir O -from 1 -to 0 regslice_control_M_AXI_bresp
create_bd_port -dir O regslice_control_M_AXI_bvalid
create_bd_port -dir O -from 31 -to 0 regslice_control_M_AXI_rdata
create_bd_port -dir I regslice_control_M_AXI_rready
create_bd_port -dir O -from 1 -to 0 regslice_control_M_AXI_rresp
create_bd_port -dir O regslice_control_M_AXI_rvalid
create_bd_port -dir I -from 31 -to 0 regslice_control_M_AXI_wdata
create_bd_port -dir O regslice_control_M_AXI_wready
create_bd_port -dir I -from 3 -to 0 regslice_control_M_AXI_wstrb
create_bd_port -dir I regslice_control_M_AXI_wvalid
create_bd_port -dir I -from 31 -to 0 regslice_control_periph_M_AXI_awaddr
create_bd_port -dir I -from 2 -to 0 regslice_control_periph_M_AXI_awprot
create_bd_port -dir I regslice_control_periph_M_AXI_awvalid
create_bd_port -dir O regslice_control_periph_M_AXI_awready
create_bd_port -dir I -from 31 -to 0 regslice_control_periph_M_AXI_wdata
create_bd_port -dir I -from 3 -to 0 regslice_control_periph_M_AXI_wstrb
create_bd_port -dir I regslice_control_periph_M_AXI_wvalid
create_bd_port -dir O regslice_control_periph_M_AXI_wready
create_bd_port -dir O -from 1 -to 0 regslice_control_periph_M_AXI_bresp
create_bd_port -dir O regslice_control_periph_M_AXI_bvalid
create_bd_port -dir I regslice_control_periph_M_AXI_bready
create_bd_port -dir I -from 31 -to 0 regslice_control_periph_M_AXI_araddr
create_bd_port -dir I -from 2 -to 0 regslice_control_periph_M_AXI_arprot
create_bd_port -dir I regslice_control_periph_M_AXI_arvalid
create_bd_port -dir O regslice_control_periph_M_AXI_arready
create_bd_port -dir O -from 31 -to 0 regslice_control_periph_M_AXI_rdata
create_bd_port -dir O -from 1 -to 0 regslice_control_periph_M_AXI_rresp
create_bd_port -dir O regslice_control_periph_M_AXI_rvalid
create_bd_port -dir I regslice_control_periph_M_AXI_rready
create_bd_port -dir I -from 24 -to 0 regslice_control_userpf_M_AXI_araddr
create_bd_port -dir I -from 2 -to 0 regslice_control_userpf_M_AXI_arprot
create_bd_port -dir O regslice_control_userpf_M_AXI_arready
create_bd_port -dir I regslice_control_userpf_M_AXI_arvalid
create_bd_port -dir I -from 24 -to 0 regslice_control_userpf_M_AXI_awaddr
create_bd_port -dir I -from 2 -to 0 regslice_control_userpf_M_AXI_awprot
create_bd_port -dir O regslice_control_userpf_M_AXI_awready
create_bd_port -dir I regslice_control_userpf_M_AXI_awvalid
create_bd_port -dir I regslice_control_userpf_M_AXI_bready
create_bd_port -dir O -from 1 -to 0 regslice_control_userpf_M_AXI_bresp
create_bd_port -dir O regslice_control_userpf_M_AXI_bvalid
create_bd_port -dir O -from 31 -to 0 regslice_control_userpf_M_AXI_rdata
create_bd_port -dir I regslice_control_userpf_M_AXI_rready
create_bd_port -dir O -from 1 -to 0 regslice_control_userpf_M_AXI_rresp
create_bd_port -dir O regslice_control_userpf_M_AXI_rvalid
create_bd_port -dir I -from 31 -to 0 regslice_control_userpf_M_AXI_wdata
create_bd_port -dir O regslice_control_userpf_M_AXI_wready
create_bd_port -dir I -from 3 -to 0 regslice_control_userpf_M_AXI_wstrb
create_bd_port -dir I regslice_control_userpf_M_AXI_wvalid
create_bd_port -dir I -from 2 -to 0 regslice_data_periph_M_AXI_awid
create_bd_port -dir I -from 39 -to 0 regslice_data_periph_M_AXI_awaddr
create_bd_port -dir I -from 7 -to 0 regslice_data_periph_M_AXI_awlen
create_bd_port -dir I -from 2 -to 0 regslice_data_periph_M_AXI_awsize
create_bd_port -dir I -from 1 -to 0 regslice_data_periph_M_AXI_awburst
create_bd_port -dir I -from 0 -to 0 regslice_data_periph_M_AXI_awlock
create_bd_port -dir I -from 3 -to 0 regslice_data_periph_M_AXI_awcache
create_bd_port -dir I -from 2 -to 0 regslice_data_periph_M_AXI_awprot
create_bd_port -dir I -from 3 -to 0 regslice_data_periph_M_AXI_awregion
create_bd_port -dir I -from 3 -to 0 regslice_data_periph_M_AXI_awqos
create_bd_port -dir I regslice_data_periph_M_AXI_awvalid
create_bd_port -dir O regslice_data_periph_M_AXI_awready
create_bd_port -dir I -from 63 -to 0 regslice_data_periph_M_AXI_wdata
create_bd_port -dir I -from 7 -to 0 regslice_data_periph_M_AXI_wstrb
create_bd_port -dir I regslice_data_periph_M_AXI_wlast
create_bd_port -dir I regslice_data_periph_M_AXI_wvalid
create_bd_port -dir O regslice_data_periph_M_AXI_wready
create_bd_port -dir O -from 2 -to 0 regslice_data_periph_M_AXI_bid
create_bd_port -dir O -from 1 -to 0 regslice_data_periph_M_AXI_bresp
create_bd_port -dir O regslice_data_periph_M_AXI_bvalid
create_bd_port -dir I regslice_data_periph_M_AXI_bready
create_bd_port -dir I -from 2 -to 0 regslice_data_periph_M_AXI_arid
create_bd_port -dir I -from 39 -to 0 regslice_data_periph_M_AXI_araddr
create_bd_port -dir I -from 7 -to 0 regslice_data_periph_M_AXI_arlen
create_bd_port -dir I -from 2 -to 0 regslice_data_periph_M_AXI_arsize
create_bd_port -dir I -from 1 -to 0 regslice_data_periph_M_AXI_arburst
create_bd_port -dir I -from 0 -to 0 regslice_data_periph_M_AXI_arlock
create_bd_port -dir I -from 3 -to 0 regslice_data_periph_M_AXI_arcache
create_bd_port -dir I -from 2 -to 0 regslice_data_periph_M_AXI_arprot
create_bd_port -dir I -from 3 -to 0 regslice_data_periph_M_AXI_arregion
create_bd_port -dir I -from 3 -to 0 regslice_data_periph_M_AXI_arqos
create_bd_port -dir I regslice_data_periph_M_AXI_arvalid
create_bd_port -dir O regslice_data_periph_M_AXI_arready
create_bd_port -dir O -from 2 -to 0 regslice_data_periph_M_AXI_rid
create_bd_port -dir O -from 63 -to 0 regslice_data_periph_M_AXI_rdata
create_bd_port -dir O -from 1 -to 0 regslice_data_periph_M_AXI_rresp
create_bd_port -dir O regslice_data_periph_M_AXI_rlast
create_bd_port -dir O regslice_data_periph_M_AXI_rvalid
create_bd_port -dir I regslice_data_periph_M_AXI_rready
create_bd_port -dir I -from 38 -to 0 regslice_data_M_AXI_slr0_araddr
create_bd_port -dir I -from 1 -to 0 regslice_data_M_AXI_slr0_arburst
create_bd_port -dir I -from 3 -to 0 regslice_data_M_AXI_slr0_arcache
create_bd_port -dir I -from 2 -to 0 regslice_data_M_AXI_slr0_arid
create_bd_port -dir I -from 7 -to 0 regslice_data_M_AXI_slr0_arlen
create_bd_port -dir I -from 0 -to 0 regslice_data_M_AXI_slr0_arlock
create_bd_port -dir I -from 2 -to 0 regslice_data_M_AXI_slr0_arprot
create_bd_port -dir I -from 3 -to 0 regslice_data_M_AXI_slr0_arqos
create_bd_port -dir O regslice_data_M_AXI_slr0_arready
create_bd_port -dir I -from 3 -to 0 regslice_data_M_AXI_slr0_arregion
create_bd_port -dir I regslice_data_M_AXI_slr0_arvalid
create_bd_port -dir I -from 38 -to 0 regslice_data_M_AXI_slr0_awaddr
create_bd_port -dir I -from 1 -to 0 regslice_data_M_AXI_slr0_awburst
create_bd_port -dir I -from 3 -to 0 regslice_data_M_AXI_slr0_awcache
create_bd_port -dir I -from 2 -to 0 regslice_data_M_AXI_slr0_awid
create_bd_port -dir I -from 7 -to 0 regslice_data_M_AXI_slr0_awlen
create_bd_port -dir I -from 0 -to 0 regslice_data_M_AXI_slr0_awlock
create_bd_port -dir I -from 2 -to 0 regslice_data_M_AXI_slr0_awprot
create_bd_port -dir I -from 3 -to 0 regslice_data_M_AXI_slr0_awqos
create_bd_port -dir O regslice_data_M_AXI_slr0_awready
create_bd_port -dir I -from 3 -to 0 regslice_data_M_AXI_slr0_awregion
create_bd_port -dir I regslice_data_M_AXI_slr0_awvalid
create_bd_port -dir O -from 2 -to 0 regslice_data_M_AXI_slr0_bid
create_bd_port -dir I regslice_data_M_AXI_slr0_bready
create_bd_port -dir O -from 1 -to 0 regslice_data_M_AXI_slr0_bresp
create_bd_port -dir O regslice_data_M_AXI_slr0_bvalid
create_bd_port -dir O -from 511 -to 0 regslice_data_M_AXI_slr0_rdata
create_bd_port -dir O -from 2 -to 0 regslice_data_M_AXI_slr0_rid
create_bd_port -dir O regslice_data_M_AXI_slr0_rlast
create_bd_port -dir I regslice_data_M_AXI_slr0_rready
create_bd_port -dir O -from 1 -to 0 regslice_data_M_AXI_slr0_rresp
create_bd_port -dir O regslice_data_M_AXI_slr0_rvalid
create_bd_port -dir I -from 511 -to 0 regslice_data_M_AXI_slr0_wdata
create_bd_port -dir I regslice_data_M_AXI_slr0_wlast
create_bd_port -dir O regslice_data_M_AXI_slr0_wready
create_bd_port -dir I -from 63 -to 0 regslice_data_M_AXI_slr0_wstrb
create_bd_port -dir I regslice_data_M_AXI_slr0_wvalid
create_bd_port -dir I -from 38 -to 0 regslice_data_M_AXI_slr1_araddr
create_bd_port -dir I -from 1 -to 0 regslice_data_M_AXI_slr1_arburst
create_bd_port -dir I -from 3 -to 0 regslice_data_M_AXI_slr1_arcache
create_bd_port -dir I -from 2 -to 0 regslice_data_M_AXI_slr1_arid
create_bd_port -dir I -from 7 -to 0 regslice_data_M_AXI_slr1_arlen
create_bd_port -dir I -from 0 -to 0 regslice_data_M_AXI_slr1_arlock
create_bd_port -dir I -from 2 -to 0 regslice_data_M_AXI_slr1_arprot
create_bd_port -dir I -from 3 -to 0 regslice_data_M_AXI_slr1_arqos
create_bd_port -dir O regslice_data_M_AXI_slr1_arready
create_bd_port -dir I -from 3 -to 0 regslice_data_M_AXI_slr1_arregion
create_bd_port -dir I regslice_data_M_AXI_slr1_arvalid
create_bd_port -dir I -from 38 -to 0 regslice_data_M_AXI_slr1_awaddr
create_bd_port -dir I -from 1 -to 0 regslice_data_M_AXI_slr1_awburst
create_bd_port -dir I -from 3 -to 0 regslice_data_M_AXI_slr1_awcache
create_bd_port -dir I -from 2 -to 0 regslice_data_M_AXI_slr1_awid
create_bd_port -dir I -from 7 -to 0 regslice_data_M_AXI_slr1_awlen
create_bd_port -dir I -from 0 -to 0 regslice_data_M_AXI_slr1_awlock
create_bd_port -dir I -from 2 -to 0 regslice_data_M_AXI_slr1_awprot
create_bd_port -dir I -from 3 -to 0 regslice_data_M_AXI_slr1_awqos
create_bd_port -dir O regslice_data_M_AXI_slr1_awready
create_bd_port -dir I -from 3 -to 0 regslice_data_M_AXI_slr1_awregion
create_bd_port -dir I regslice_data_M_AXI_slr1_awvalid
create_bd_port -dir O -from 2 -to 0 regslice_data_M_AXI_slr1_bid
create_bd_port -dir I regslice_data_M_AXI_slr1_bready
create_bd_port -dir O -from 1 -to 0 regslice_data_M_AXI_slr1_bresp
create_bd_port -dir O regslice_data_M_AXI_slr1_bvalid
create_bd_port -dir O -from 511 -to 0 regslice_data_M_AXI_slr1_rdata
create_bd_port -dir O -from 2 -to 0 regslice_data_M_AXI_slr1_rid
create_bd_port -dir O regslice_data_M_AXI_slr1_rlast
create_bd_port -dir I regslice_data_M_AXI_slr1_rready
create_bd_port -dir O -from 1 -to 0 regslice_data_M_AXI_slr1_rresp
create_bd_port -dir O regslice_data_M_AXI_slr1_rvalid
create_bd_port -dir I -from 511 -to 0 regslice_data_M_AXI_slr1_wdata
create_bd_port -dir I regslice_data_M_AXI_slr1_wlast
create_bd_port -dir O regslice_data_M_AXI_slr1_wready
create_bd_port -dir I -from 63 -to 0 regslice_data_M_AXI_slr1_wstrb
create_bd_port -dir I regslice_data_M_AXI_slr1_wvalid
create_bd_port -dir I -from 38 -to 0 regslice_data_M_AXI_slr2_araddr
create_bd_port -dir I -from 1 -to 0 regslice_data_M_AXI_slr2_arburst
create_bd_port -dir I -from 3 -to 0 regslice_data_M_AXI_slr2_arcache
create_bd_port -dir I -from 2 -to 0 regslice_data_M_AXI_slr2_arid
create_bd_port -dir I -from 7 -to 0 regslice_data_M_AXI_slr2_arlen
create_bd_port -dir I -from 0 -to 0 regslice_data_M_AXI_slr2_arlock
create_bd_port -dir I -from 2 -to 0 regslice_data_M_AXI_slr2_arprot
create_bd_port -dir I -from 3 -to 0 regslice_data_M_AXI_slr2_arqos
create_bd_port -dir O regslice_data_M_AXI_slr2_arready
create_bd_port -dir I -from 3 -to 0 regslice_data_M_AXI_slr2_arregion
create_bd_port -dir I regslice_data_M_AXI_slr2_arvalid
create_bd_port -dir I -from 38 -to 0 regslice_data_M_AXI_slr2_awaddr
create_bd_port -dir I -from 1 -to 0 regslice_data_M_AXI_slr2_awburst
create_bd_port -dir I -from 3 -to 0 regslice_data_M_AXI_slr2_awcache
create_bd_port -dir I -from 2 -to 0 regslice_data_M_AXI_slr2_awid
create_bd_port -dir I -from 7 -to 0 regslice_data_M_AXI_slr2_awlen
create_bd_port -dir I -from 0 -to 0 regslice_data_M_AXI_slr2_awlock
create_bd_port -dir I -from 2 -to 0 regslice_data_M_AXI_slr2_awprot
create_bd_port -dir I -from 3 -to 0 regslice_data_M_AXI_slr2_awqos
create_bd_port -dir O regslice_data_M_AXI_slr2_awready
create_bd_port -dir I -from 3 -to 0 regslice_data_M_AXI_slr2_awregion
create_bd_port -dir I regslice_data_M_AXI_slr2_awvalid
create_bd_port -dir O -from 2 -to 0 regslice_data_M_AXI_slr2_bid
create_bd_port -dir I regslice_data_M_AXI_slr2_bready
create_bd_port -dir O -from 1 -to 0 regslice_data_M_AXI_slr2_bresp
create_bd_port -dir O regslice_data_M_AXI_slr2_bvalid
create_bd_port -dir O -from 511 -to 0 regslice_data_M_AXI_slr2_rdata
create_bd_port -dir O -from 2 -to 0 regslice_data_M_AXI_slr2_rid
create_bd_port -dir O regslice_data_M_AXI_slr2_rlast
create_bd_port -dir I regslice_data_M_AXI_slr2_rready
create_bd_port -dir O -from 1 -to 0 regslice_data_M_AXI_slr2_rresp
create_bd_port -dir O regslice_data_M_AXI_slr2_rvalid
create_bd_port -dir I -from 511 -to 0 regslice_data_M_AXI_slr2_wdata
create_bd_port -dir I regslice_data_M_AXI_slr2_wlast
create_bd_port -dir O regslice_data_M_AXI_slr2_wready
create_bd_port -dir I -from 63 -to 0 regslice_data_M_AXI_slr2_wstrb
create_bd_port -dir I regslice_data_M_AXI_slr2_wvalid
create_bd_port -dir I -from 38 -to 0 regslice_data_M_AXI_slr3_araddr
create_bd_port -dir I -from 1 -to 0 regslice_data_M_AXI_slr3_arburst
create_bd_port -dir I -from 3 -to 0 regslice_data_M_AXI_slr3_arcache
create_bd_port -dir I -from 2 -to 0 regslice_data_M_AXI_slr3_arid
create_bd_port -dir I -from 7 -to 0 regslice_data_M_AXI_slr3_arlen
create_bd_port -dir I -from 0 -to 0 regslice_data_M_AXI_slr3_arlock
create_bd_port -dir I -from 2 -to 0 regslice_data_M_AXI_slr3_arprot
create_bd_port -dir I -from 3 -to 0 regslice_data_M_AXI_slr3_arqos
create_bd_port -dir O regslice_data_M_AXI_slr3_arready
create_bd_port -dir I -from 3 -to 0 regslice_data_M_AXI_slr3_arregion
create_bd_port -dir I regslice_data_M_AXI_slr3_arvalid
create_bd_port -dir I -from 38 -to 0 regslice_data_M_AXI_slr3_awaddr
create_bd_port -dir I -from 1 -to 0 regslice_data_M_AXI_slr3_awburst
create_bd_port -dir I -from 3 -to 0 regslice_data_M_AXI_slr3_awcache
create_bd_port -dir I -from 2 -to 0 regslice_data_M_AXI_slr3_awid
create_bd_port -dir I -from 7 -to 0 regslice_data_M_AXI_slr3_awlen
create_bd_port -dir I -from 0 -to 0 regslice_data_M_AXI_slr3_awlock
create_bd_port -dir I -from 2 -to 0 regslice_data_M_AXI_slr3_awprot
create_bd_port -dir I -from 3 -to 0 regslice_data_M_AXI_slr3_awqos
create_bd_port -dir O regslice_data_M_AXI_slr3_awready
create_bd_port -dir I -from 3 -to 0 regslice_data_M_AXI_slr3_awregion
create_bd_port -dir I regslice_data_M_AXI_slr3_awvalid
create_bd_port -dir O -from 2 -to 0 regslice_data_M_AXI_slr3_bid
create_bd_port -dir I regslice_data_M_AXI_slr3_bready
create_bd_port -dir O -from 1 -to 0 regslice_data_M_AXI_slr3_bresp
create_bd_port -dir O regslice_data_M_AXI_slr3_bvalid
create_bd_port -dir O -from 511 -to 0 regslice_data_M_AXI_slr3_rdata
create_bd_port -dir O -from 2 -to 0 regslice_data_M_AXI_slr3_rid
create_bd_port -dir O regslice_data_M_AXI_slr3_rlast
create_bd_port -dir I regslice_data_M_AXI_slr3_rready
create_bd_port -dir O -from 1 -to 0 regslice_data_M_AXI_slr3_rresp
create_bd_port -dir O regslice_data_M_AXI_slr3_rvalid
create_bd_port -dir I -from 511 -to 0 regslice_data_M_AXI_slr3_wdata
create_bd_port -dir I regslice_data_M_AXI_slr3_wlast
create_bd_port -dir O regslice_data_M_AXI_slr3_wready
create_bd_port -dir I -from 63 -to 0 regslice_data_M_AXI_slr3_wstrb
create_bd_port -dir I regslice_data_M_AXI_slr3_wvalid

create_bd_cell -type ip -vlnv xilinx.com:ip:debug_bridge:3.0 debug_bridge_xsdbm
set_property -dict [list \
  CONFIG.C_DEBUG_MODE 1 \
  CONFIG.C_DESIGN_TYPE 1 \
  CONFIG.C_ENABLE_CLK_DIVIDER false \
] [get_bd_cells debug_bridge_xsdbm]
create_bd_cell -type hier interrupt_concat
create_bd_cell -type ip -vlnv xilinx.com:ip:util_vector_logic:2.0 logic_reset_op
set_property -dict {CONFIG.C_OPERATION not CONFIG.C_SIZE 1} [get_bd_cells logic_reset_op]
create_bd_cell -type ip -vlnv xilinx.com:ip:axi_register_slice:2.1 regslice_periph_null
set_property -dict [list \
  CONFIG.ADDR_WIDTH 40 \
  CONFIG.DATA_WIDTH 64 \
  CONFIG.PROTOCOL AXI4 \
  CONFIG.READ_WRITE_MODE READ_WRITE \
  CONFIG.REG_AR 0 \
  CONFIG.REG_AW 0 \
  CONFIG.REG_B 0 \
  CONFIG.REG_R 0 \
  CONFIG.REG_W 0 \
] [get_bd_cells regslice_periph_null]
create_bd_cell -type ip -vlnv xilinx.com:ip:sdx_memory_subsystem:1.0 memory_subsystem
set_property -dict [list \
  CONFIG.ADVANCED_PROPERTIES {resource_access_constraints { S00_AXI {DDR4_MEM00 PLRAM_MEM00} S01_AXI {DDR4_MEM01 PLRAM_MEM01} S02_AXI {DDR4_MEM02 PLRAM_MEM02} S03_AXI {DDR4_MEM03 PLRAM_MEM03} } resource_map_replication { S00_AXI {} S01_AXI {} S02_AXI {} S03_AXI {} } plram_specifications {{ SIZE 128K AXI_DATA_WIDTH 512 SLR_ASSIGNMENT SLR0 } { SIZE 128K AXI_DATA_WIDTH 512 SLR_ASSIGNMENT SLR1 } { SIZE 128K AXI_DATA_WIDTH 512 SLR_ASSIGNMENT SLR2 } { SIZE 128K AXI_DATA_WIDTH 512 SLR_ASSIGNMENT SLR3 }} } \
  CONFIG.NUM_CLKS 2 \
  CONFIG.NUM_SI 4 \
] [get_bd_cells memory_subsystem]
create_bd_cell -type hier slr0
create_bd_cell -type hier slr1
create_bd_cell -type hier slr2
create_bd_cell -type hier slr3

# ---- hierarchy /interrupt_concat ----
current_bd_instance /interrupt_concat
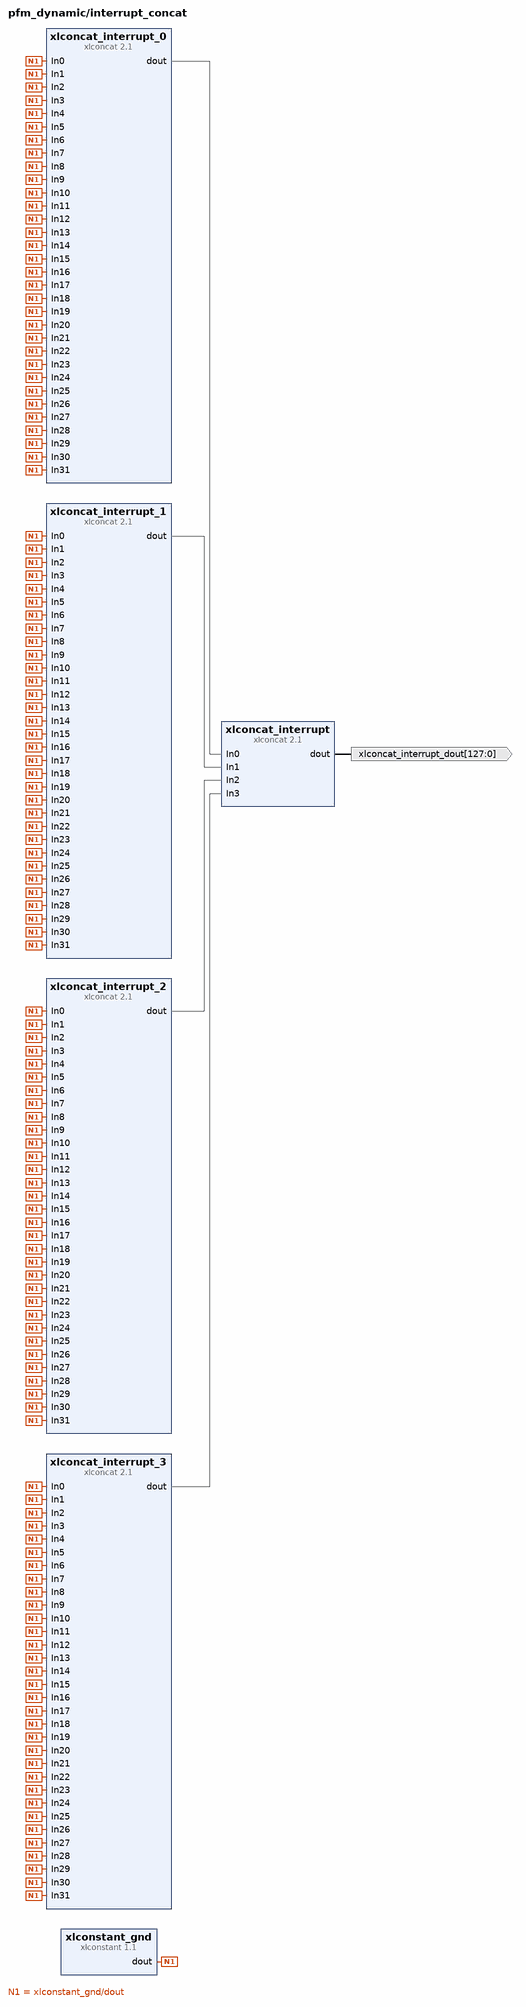
[diagram p7: block diagram inside /interrupt_concat]
create_bd_pin -dir O -from 127 -to 0 xlconcat_interrupt_dout

create_bd_cell -type ip -vlnv xilinx.com:ip:xlconcat:2.1 xlconcat_interrupt
set_property -dict {CONFIG.NUM_PORTS 4} [get_bd_cells xlconcat_interrupt]
create_bd_cell -type ip -vlnv xilinx.com:ip:xlconcat:2.1 xlconcat_interrupt_0
set_property -dict {CONFIG.NUM_PORTS 32} [get_bd_cells xlconcat_interrupt_0]
create_bd_cell -type ip -vlnv xilinx.com:ip:xlconcat:2.1 xlconcat_interrupt_1
set_property -dict {CONFIG.NUM_PORTS 32} [get_bd_cells xlconcat_interrupt_1]
create_bd_cell -type ip -vlnv xilinx.com:ip:xlconcat:2.1 xlconcat_interrupt_2
set_property -dict {CONFIG.NUM_PORTS 32} [get_bd_cells xlconcat_interrupt_2]
create_bd_cell -type ip -vlnv xilinx.com:ip:xlconcat:2.1 xlconcat_interrupt_3
set_property -dict {CONFIG.NUM_PORTS 32} [get_bd_cells xlconcat_interrupt_3]
create_bd_cell -type ip -vlnv xilinx.com:ip:xlconstant:1.1 xlconstant_gnd
set_property -dict {CONFIG.CONST_VAL 0} [get_bd_cells xlconstant_gnd]

# ---- hierarchy /slr0 ----
current_bd_instance /slr0
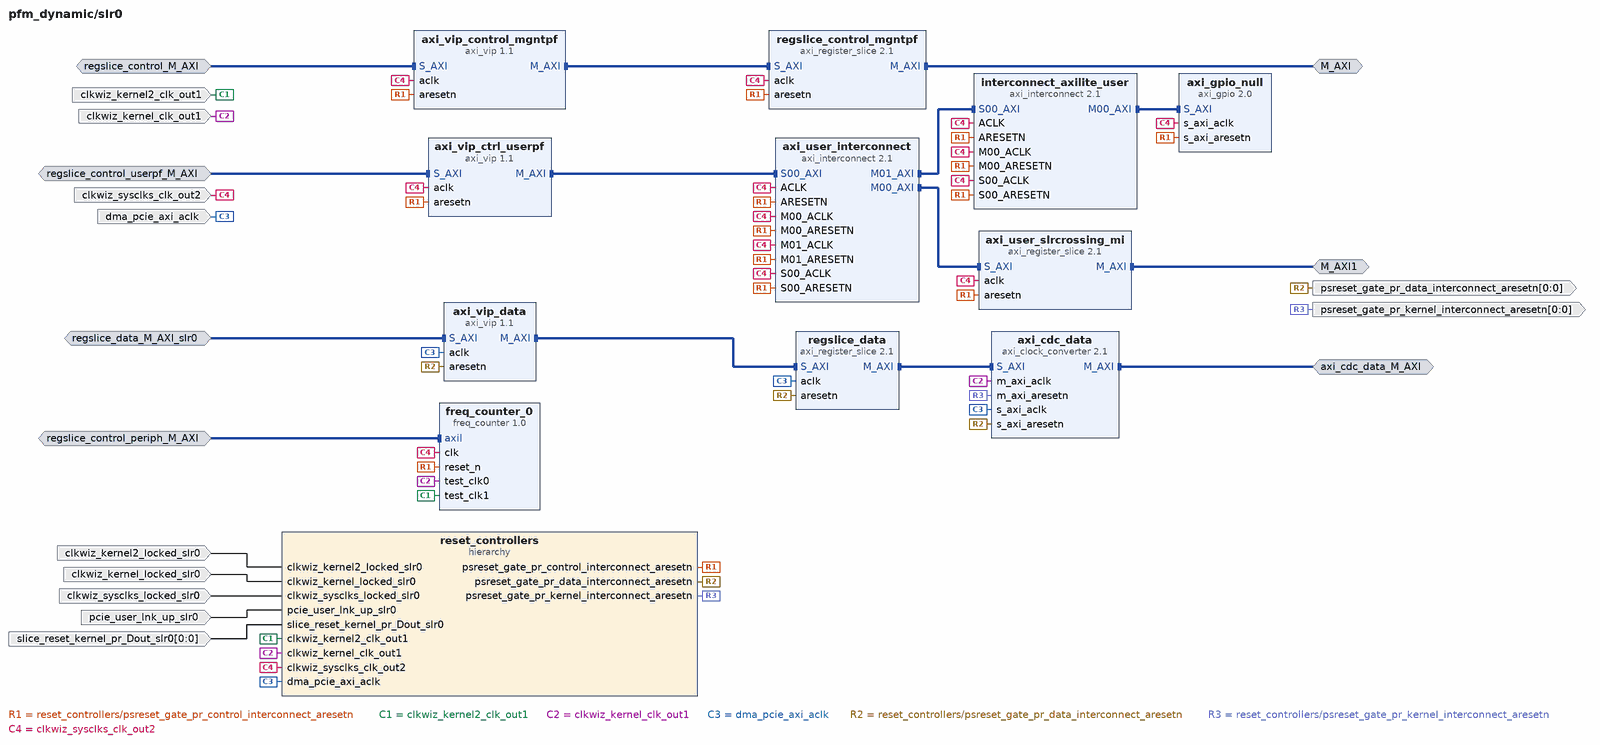
[diagram p8: block diagram inside /slr0]
create_bd_intf_pin -mode Master -vlnv xilinx.com:interface:aximm_rtl:1.0 M_AXI
create_bd_intf_pin -mode Master -vlnv xilinx.com:interface:aximm_rtl:1.0 M_AXI1
create_bd_intf_pin -mode Master -vlnv xilinx.com:interface:aximm_rtl:1.0 axi_cdc_data_M_AXI
create_bd_intf_pin -mode Slave -vlnv xilinx.com:interface:aximm_rtl:1.0 regslice_control_M_AXI
create_bd_intf_pin -mode Slave -vlnv xilinx.com:interface:aximm_rtl:1.0 regslice_control_periph_M_AXI
create_bd_intf_pin -mode Slave -vlnv xilinx.com:interface:aximm_rtl:1.0 regslice_control_userpf_M_AXI
create_bd_intf_pin -mode Slave -vlnv xilinx.com:interface:aximm_rtl:1.0 regslice_data_M_AXI_slr0
create_bd_pin -dir I -type clk clkwiz_kernel2_clk_out1
create_bd_pin -dir I clkwiz_kernel2_locked_slr0
create_bd_pin -dir I -type clk clkwiz_kernel_clk_out1
create_bd_pin -dir I clkwiz_kernel_locked_slr0
create_bd_pin -dir I -type clk clkwiz_sysclks_clk_out2
create_bd_pin -dir I clkwiz_sysclks_locked_slr0
create_bd_pin -dir I -type clk dma_pcie_axi_aclk
create_bd_pin -dir I pcie_user_lnk_up_slr0
create_bd_pin -dir O -from 0 -to 0 -type rst psreset_gate_pr_data_interconnect_aresetn
create_bd_pin -dir O -from 0 -to 0 -type rst psreset_gate_pr_kernel_interconnect_aresetn
create_bd_pin -dir I -from 0 -to 0 -type rst slice_reset_kernel_pr_Dout_slr0

create_bd_cell -type ip -vlnv xilinx.com:ip:axi_clock_converter:2.1 axi_cdc_data
set_property -dict {CONFIG.SLR_ASSIGNMENTS SLR0} [get_bd_cells axi_cdc_data]
create_bd_cell -type ip -vlnv xilinx.com:ip:axi_gpio:2.0 axi_gpio_null
create_bd_cell -type ip -vlnv xilinx.com:ip:axi_interconnect:2.1 axi_user_interconnect
set_property -dict [list \
  CONFIG.M00_HAS_REGSLICE 4 \
  CONFIG.M01_HAS_REGSLICE 4 \
  CONFIG.S00_HAS_REGSLICE 4 \
] [get_bd_cells axi_user_interconnect]
create_bd_cell -type ip -vlnv xilinx.com:ip:axi_register_slice:2.1 axi_user_slrcrossing_mi
set_property -dict [list \
  CONFIG.ADDR_WIDTH 26 \
  CONFIG.PROTOCOL AXI4LITE \
  CONFIG.READ_WRITE_MODE READ_WRITE \
  CONFIG.REG_AR 7 \
  CONFIG.REG_AW 7 \
  CONFIG.REG_B 9 \
  CONFIG.REG_R 9 \
  CONFIG.REG_W 7 \
] [get_bd_cells axi_user_slrcrossing_mi]
create_bd_cell -type ip -vlnv xilinx.com:ip:axi_vip:1.1 axi_vip_control_mgntpf
create_bd_cell -type ip -vlnv xilinx.com:ip:axi_vip:1.1 axi_vip_ctrl_userpf
create_bd_cell -type ip -vlnv xilinx.com:ip:axi_vip:1.1 axi_vip_data
create_bd_cell -type ip -vlnv xilinx.com:user:freq_counter:1.0 freq_counter_0
set_property -dict {CONFIG.REF_CLK_FREQ_HZ 50925} [get_bd_cells freq_counter_0]
create_bd_cell -type ip -vlnv xilinx.com:ip:axi_interconnect:2.1 interconnect_axilite_user
set_property -dict [list \
  CONFIG.M00_HAS_REGSLICE 4 \
  CONFIG.M01_HAS_REGSLICE 4 \
  CONFIG.M02_HAS_REGSLICE 4 \
  CONFIG.M03_HAS_REGSLICE 4 \
  CONFIG.M04_HAS_REGSLICE 4 \
  CONFIG.M05_HAS_REGSLICE 4 \
  CONFIG.M06_HAS_REGSLICE 4 \
  CONFIG.M07_HAS_REGSLICE 4 \
  CONFIG.M08_HAS_REGSLICE 4 \
  CONFIG.M09_HAS_REGSLICE 4 \
  CONFIG.M10_HAS_REGSLICE 4 \
  CONFIG.M11_HAS_REGSLICE 4 \
  CONFIG.M12_HAS_REGSLICE 4 \
  CONFIG.M13_HAS_REGSLICE 4 \
  CONFIG.M14_HAS_REGSLICE 4 \
  CONFIG.M15_HAS_REGSLICE 4 \
  CONFIG.M16_HAS_REGSLICE 4 \
  CONFIG.M17_HAS_REGSLICE 4 \
  CONFIG.M18_HAS_REGSLICE 4 \
  CONFIG.M19_HAS_REGSLICE 4 \
  CONFIG.M20_HAS_REGSLICE 4 \
  CONFIG.M21_HAS_REGSLICE 4 \
  CONFIG.M22_HAS_REGSLICE 4 \
  CONFIG.M23_HAS_REGSLICE 4 \
  CONFIG.M24_HAS_REGSLICE 4 \
  CONFIG.M25_HAS_REGSLICE 4 \
  CONFIG.M26_HAS_REGSLICE 4 \
  CONFIG.M27_HAS_REGSLICE 4 \
  CONFIG.M28_HAS_REGSLICE 4 \
  CONFIG.M29_HAS_REGSLICE 4 \
  CONFIG.M30_HAS_REGSLICE 4 \
  CONFIG.M31_HAS_REGSLICE 4 \
  CONFIG.M32_HAS_REGSLICE 4 \
  CONFIG.M33_HAS_REGSLICE 4 \
  CONFIG.M34_HAS_REGSLICE 4 \
  CONFIG.M35_HAS_REGSLICE 4 \
  CONFIG.M36_HAS_REGSLICE 4 \
  CONFIG.M37_HAS_REGSLICE 4 \
  CONFIG.M38_HAS_REGSLICE 4 \
  CONFIG.M39_HAS_REGSLICE 4 \
  CONFIG.M40_HAS_REGSLICE 4 \
  CONFIG.M41_HAS_REGSLICE 4 \
  CONFIG.M42_HAS_REGSLICE 4 \
  CONFIG.M43_HAS_REGSLICE 4 \
  CONFIG.M44_HAS_REGSLICE 4 \
  CONFIG.M45_HAS_REGSLICE 4 \
  CONFIG.M46_HAS_REGSLICE 4 \
  CONFIG.M47_HAS_REGSLICE 4 \
  CONFIG.M48_HAS_REGSLICE 4 \
  CONFIG.M49_HAS_REGSLICE 4 \
  CONFIG.M50_HAS_REGSLICE 4 \
  CONFIG.M51_HAS_REGSLICE 4 \
  CONFIG.M52_HAS_REGSLICE 4 \
  CONFIG.M53_HAS_REGSLICE 4 \
  CONFIG.M54_HAS_REGSLICE 4 \
  CONFIG.M55_HAS_REGSLICE 4 \
  CONFIG.M56_HAS_REGSLICE 4 \
  CONFIG.M57_HAS_REGSLICE 4 \
  CONFIG.M58_HAS_REGSLICE 4 \
  CONFIG.M59_HAS_REGSLICE 4 \
  CONFIG.M60_HAS_REGSLICE 4 \
  CONFIG.M61_HAS_REGSLICE 4 \
  CONFIG.M62_HAS_REGSLICE 4 \
  CONFIG.M63_HAS_REGSLICE 4 \
  CONFIG.NUM_MI 1 \
  CONFIG.S00_HAS_REGSLICE 4 \
  CONFIG.SLR_ASSIGNMENTS SLR0 \
] [get_bd_cells interconnect_axilite_user]
create_bd_cell -type ip -vlnv xilinx.com:ip:axi_register_slice:2.1 regslice_control_mgntpf
set_property -dict [list \
  CONFIG.ADDR_WIDTH 26 \
  CONFIG.DATA_WIDTH 32 \
  CONFIG.PROTOCOL AXI4LITE \
  CONFIG.READ_WRITE_MODE READ_WRITE \
  CONFIG.REG_R 7 \
  CONFIG.REG_W 7 \
  CONFIG.SLR_ASSIGNMENTS SLR0 \
] [get_bd_cells regslice_control_mgntpf]
create_bd_cell -type ip -vlnv xilinx.com:ip:axi_register_slice:2.1 regslice_data
set_property -dict [list \
  CONFIG.ADDR_WIDTH 39 \
  CONFIG.DATA_WIDTH 512 \
  CONFIG.ID_WIDTH 3 \
  CONFIG.PROTOCOL AXI4 \
  CONFIG.READ_WRITE_MODE READ_WRITE \
  CONFIG.REG_AR 1 \
  CONFIG.REG_AW 1 \
  CONFIG.REG_B 1 \
  CONFIG.REG_W 1 \
  CONFIG.SLR_ASSIGNMENTS SLR0 \
] [get_bd_cells regslice_data]
create_bd_cell -type hier reset_controllers

# ---- hierarchy /slr0/reset_controllers ----
current_bd_instance /slr0/reset_controllers
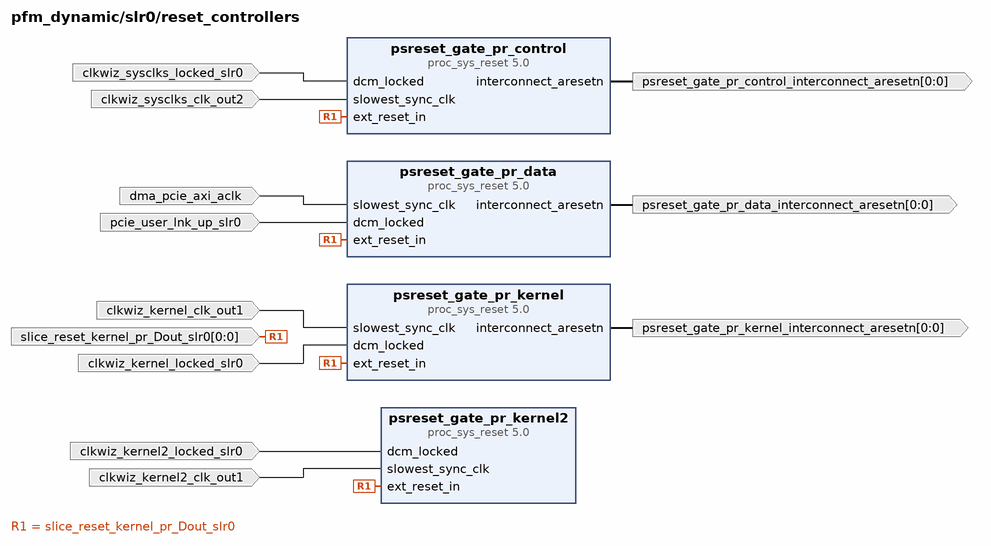
[diagram p9: block diagram inside /slr0/reset_controllers]
create_bd_pin -dir I -type clk clkwiz_kernel2_clk_out1
create_bd_pin -dir I clkwiz_kernel2_locked_slr0
create_bd_pin -dir I -type clk clkwiz_kernel_clk_out1
create_bd_pin -dir I clkwiz_kernel_locked_slr0
create_bd_pin -dir I -type clk clkwiz_sysclks_clk_out2
create_bd_pin -dir I clkwiz_sysclks_locked_slr0
create_bd_pin -dir I -type clk dma_pcie_axi_aclk
create_bd_pin -dir I pcie_user_lnk_up_slr0
create_bd_pin -dir O -from 0 -to 0 -type rst psreset_gate_pr_control_interconnect_aresetn
create_bd_pin -dir O -from 0 -to 0 -type rst psreset_gate_pr_data_interconnect_aresetn
create_bd_pin -dir O -from 0 -to 0 -type rst psreset_gate_pr_kernel_interconnect_aresetn
create_bd_pin -dir I -from 0 -to 0 -type rst slice_reset_kernel_pr_Dout_slr0

create_bd_cell -type ip -vlnv xilinx.com:ip:proc_sys_reset:5.0 psreset_gate_pr_control
set_property -dict [list \
  CONFIG.C_AUX_RESET_HIGH 0 \
  CONFIG.C_AUX_RST_WIDTH 1 \
  CONFIG.C_EXT_RST_WIDTH 1 \
  CONFIG.SLR_ASSIGNMENTS SLR0 \
] [get_bd_cells psreset_gate_pr_control]
create_bd_cell -type ip -vlnv xilinx.com:ip:proc_sys_reset:5.0 psreset_gate_pr_data
set_property -dict [list \
  CONFIG.C_AUX_RESET_HIGH 0 \
  CONFIG.C_AUX_RST_WIDTH 1 \
  CONFIG.C_EXT_RST_WIDTH 1 \
  CONFIG.SLR_ASSIGNMENTS SLR0 \
] [get_bd_cells psreset_gate_pr_data]
create_bd_cell -type ip -vlnv xilinx.com:ip:proc_sys_reset:5.0 psreset_gate_pr_kernel
set_property -dict [list \
  CONFIG.C_AUX_RESET_HIGH 0 \
  CONFIG.C_AUX_RST_WIDTH 1 \
  CONFIG.C_EXT_RST_WIDTH 1 \
  CONFIG.SLR_ASSIGNMENTS SLR0 \
] [get_bd_cells psreset_gate_pr_kernel]
create_bd_cell -type ip -vlnv xilinx.com:ip:proc_sys_reset:5.0 psreset_gate_pr_kernel2
set_property -dict [list \
  CONFIG.C_AUX_RESET_HIGH 0 \
  CONFIG.C_AUX_RST_WIDTH 1 \
  CONFIG.C_EXT_RST_WIDTH 1 \
  CONFIG.SLR_ASSIGNMENTS SLR0 \
] [get_bd_cells psreset_gate_pr_kernel2]

# ---- hierarchy /slr1 ----
current_bd_instance /slr1
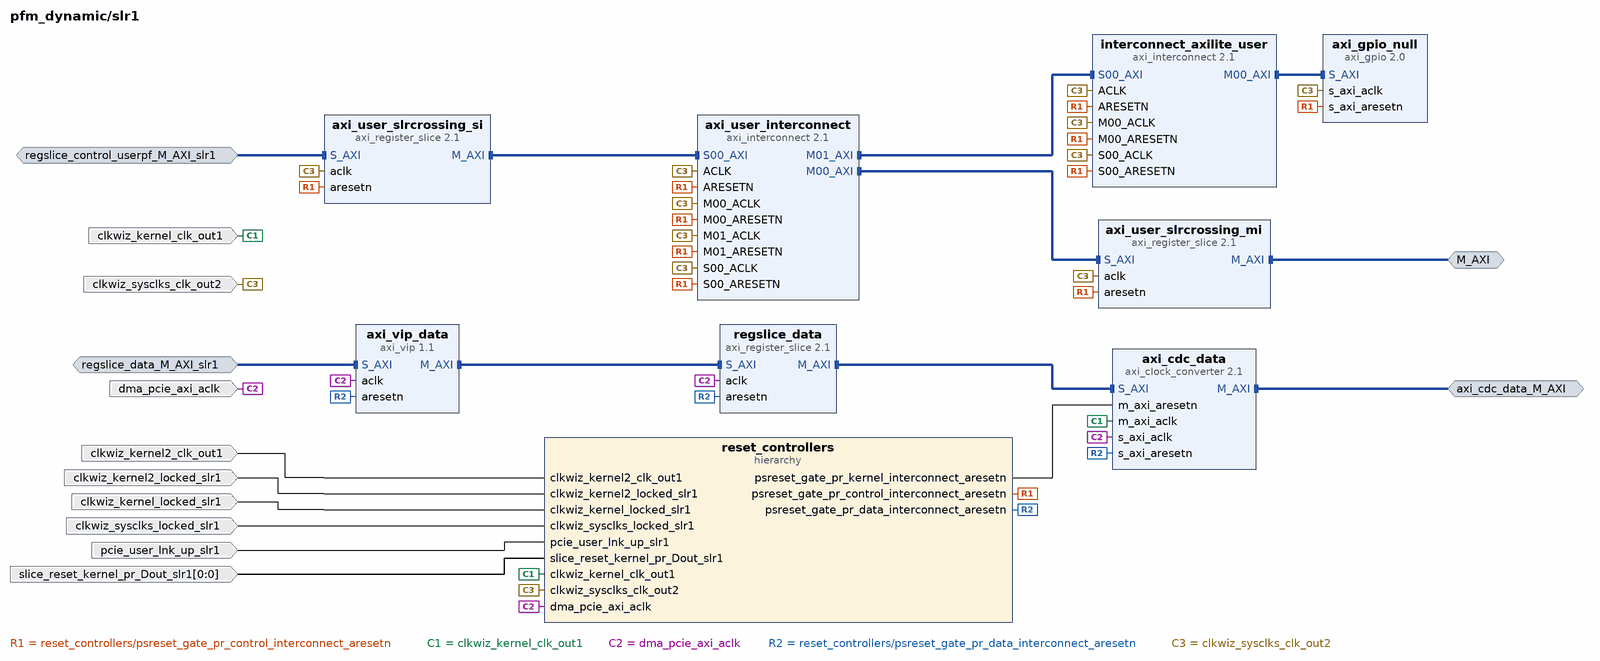
[diagram p10: block diagram inside /slr1]
create_bd_intf_pin -mode Master -vlnv xilinx.com:interface:aximm_rtl:1.0 M_AXI
create_bd_intf_pin -mode Master -vlnv xilinx.com:interface:aximm_rtl:1.0 axi_cdc_data_M_AXI
create_bd_intf_pin -mode Slave -vlnv xilinx.com:interface:aximm_rtl:1.0 regslice_control_userpf_M_AXI_slr1
create_bd_intf_pin -mode Slave -vlnv xilinx.com:interface:aximm_rtl:1.0 regslice_data_M_AXI_slr1
create_bd_pin -dir I -type clk clkwiz_kernel2_clk_out1
create_bd_pin -dir I clkwiz_kernel2_locked_slr1
create_bd_pin -dir I -type clk clkwiz_kernel_clk_out1
create_bd_pin -dir I clkwiz_kernel_locked_slr1
create_bd_pin -dir I -type clk clkwiz_sysclks_clk_out2
create_bd_pin -dir I clkwiz_sysclks_locked_slr1
create_bd_pin -dir I -type clk dma_pcie_axi_aclk
create_bd_pin -dir I pcie_user_lnk_up_slr1
create_bd_pin -dir I -from 0 -to 0 -type rst slice_reset_kernel_pr_Dout_slr1
